# Altium project Audio_DevBoard_V1.PrjPcb
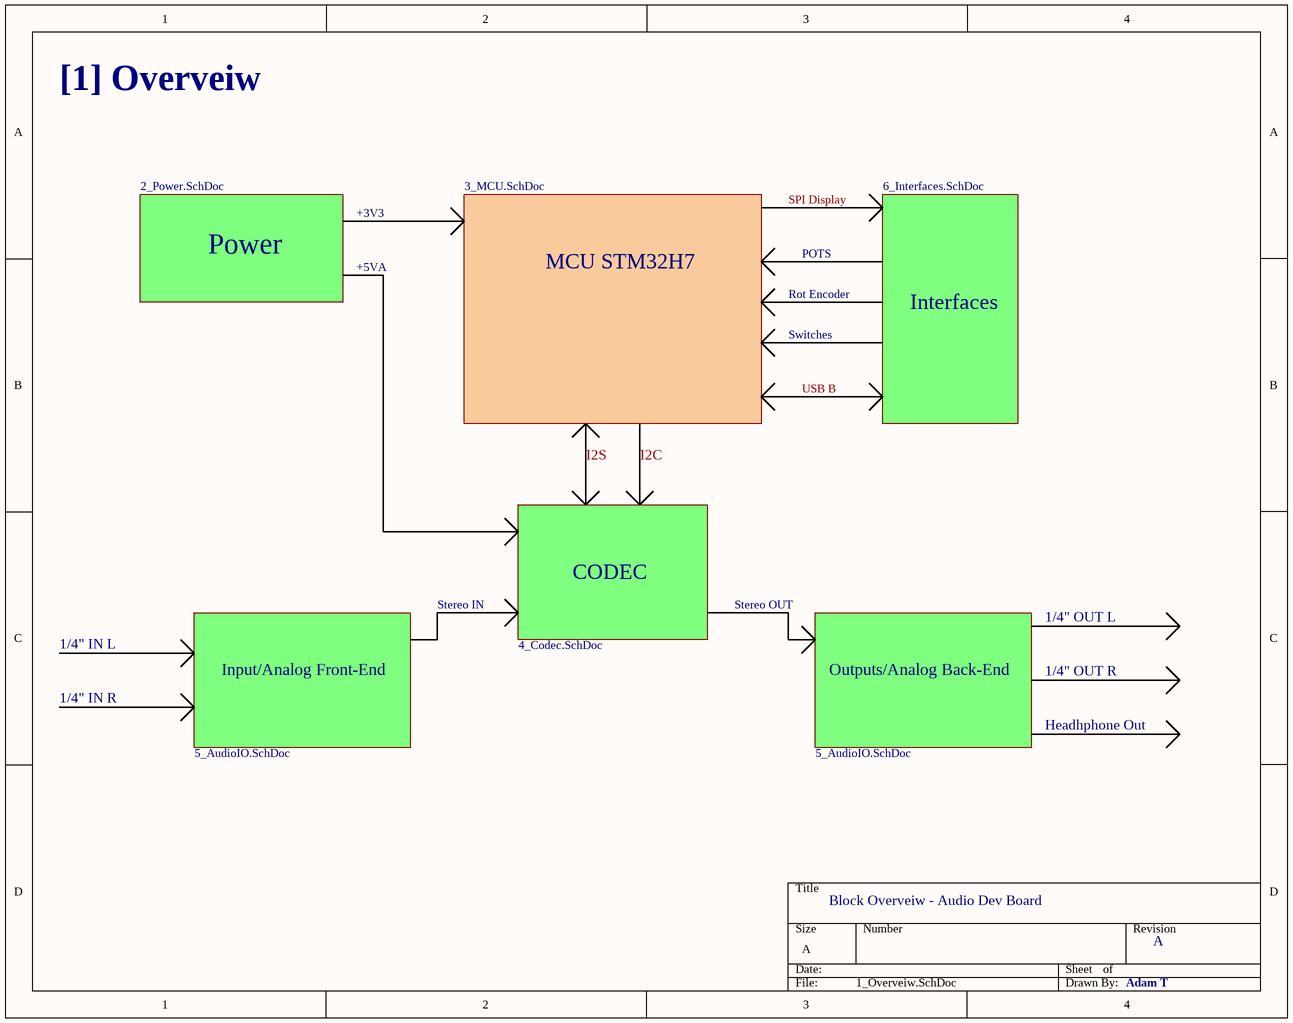
[diagram p0: 1_Overveiw.SchDoc]
6 sheets, 326 parts. Net scope: global (net labels, ports and power ports of the same name join across sheets).
Board file: Audio_DevBoard_V1_PCB.PcbDoc
Sheets:
  1_Overveiw.SchDoc
    Power = 2_Power.SchDoc
    MCU STM32H7 = 3_MCU.SchDoc
    CODEC = 4_Codec.SchDoc
    Input/Analog Front-End = 5_AudioIO.SchDoc
    Interfaces = 6_Interfaces.SchDoc
    Outputs/Analog Back-End = 5_AudioIO.SchDoc

## Sheet 1_Overveiw.SchDoc
size A; SheetNumber: 1; SheetTotal: 6

### Sub-sheets
CODEC = 4_Codec.SchDoc: no entries
Input/Analog Front-End = 5_AudioIO.SchDoc: no entries
Interfaces = 6_Interfaces.SchDoc: no entries
MCU STM32H7 = 3_MCU.SchDoc: no entries
Outputs/Analog Back-End = 5_AudioIO.SchDoc: no entries
Power = 2_Power.SchDoc: no entries

### Notes on the sheet
- [1] Overveiw
- +3V3
- SPI Display
- +5VA
- Rot Encoder
- POTS
- Switches
- USB B
- I2S
- I2C
- Stereo IN
- Stereo OUT
- 1/4" OUT L
- 1/4" IN L
- 1/4" IN R
- 1/4" OUT R
- Headhphone Out
- Block Overveiw - Audio Dev Board
- A
- Adam T

## Sheet 2_Power.SchDoc
size A; SheetNumber: 2; SheetTotal: 6
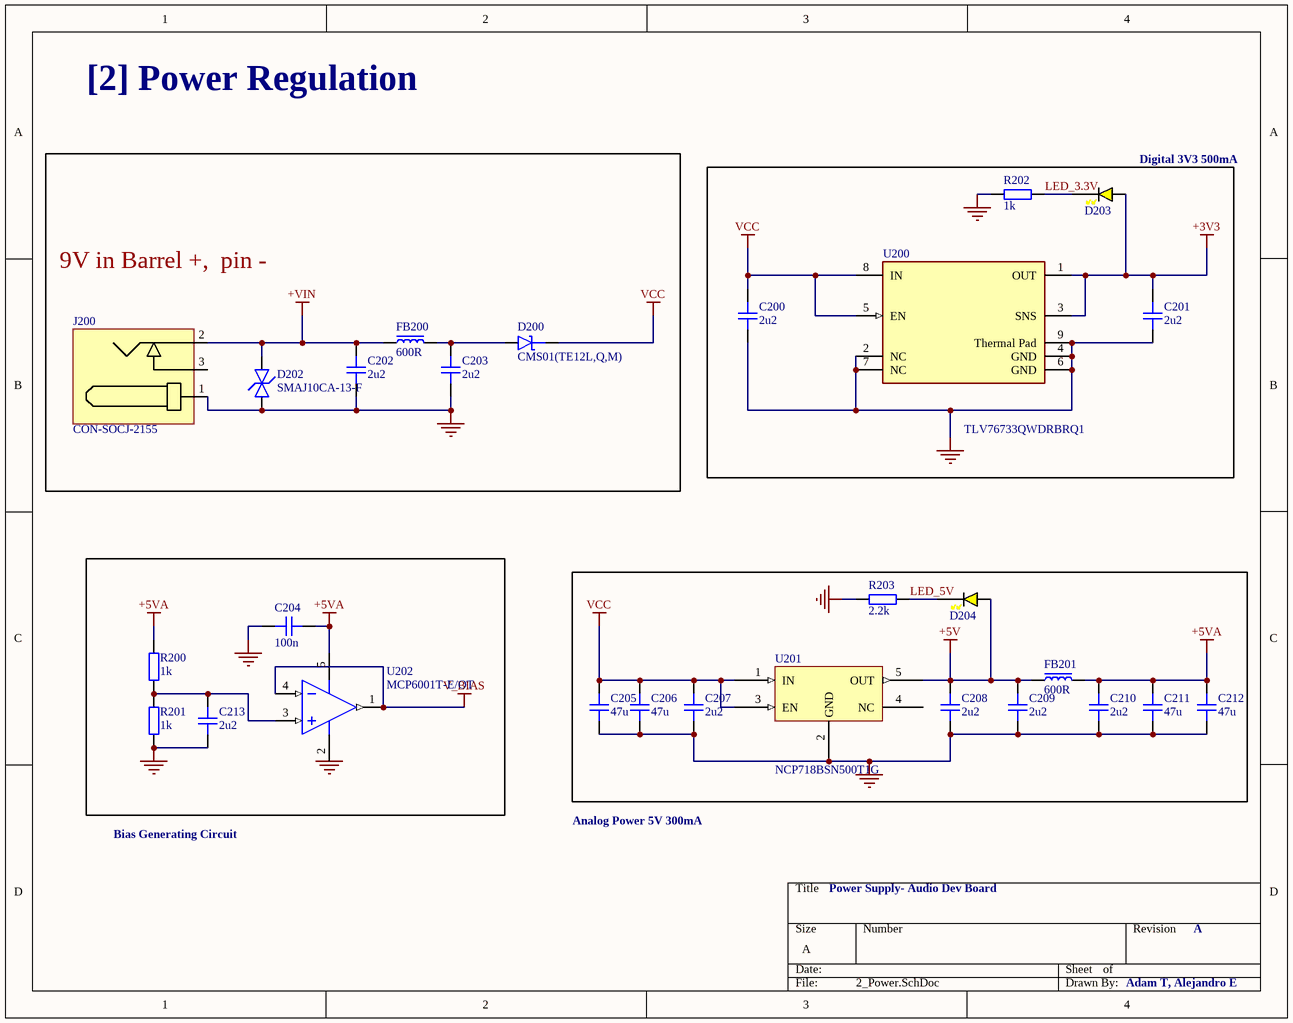
[diagram p1: 2_Power.SchDoc]

### Parts
C200  2u2  [CAP_0402]
C201  2u2  [CAP_0402]
C202  2u2  [CAP_0402]
C203  2u2  [CAP_0402]
C204  100n  [CAP_0402]
C205  47u  [CAP_1210]
C206  47u  [CAP_1210]
C207  2u2  [CAP_0402]
C208  2u2  [CAP_0402]
C209  2u2  [CAP_0402]
C210  2u2  [CAP_0402]
C211  47u  [CAP_1210]
C212  47u  [CAP_1210]
C213  2u2  [CAP_0402]
D200  CMS01(TE12L,Q,M)  [SOD_128]
D202  SMAJ10CA-13-F  [SMAJ10CA-13-F]
D203  YELLOW  [LED_0402_YELLOW]  (value not drawn)
D204  YELLOW  [LED_0402_YELLOW]  (value not drawn)
FB200  600R  [FB_0805]
FB201  600R  [FB_0805]
J200  CON-SOCJ-2155  [CON-SOCJ-2155]
R200  1k  [RES_0402]
R201  1k  [RES_0402]
R202  1k  [RES_0402]
R203  2.2k  [RES_0402]
U200  TLV76733QWDRBRQ1  [FP-DRB0008J-IPC_C]
U201  NCP718BSN500T1G  [TSOT25]
U202  MCP6001T-E/OT  [SOT-23-OT5_L]

### Blocks framed on the sheet
9V in Barrel +,  pin -: C202 C203 D200 D202 FB200 J200
Digital 3V3 500mA: C200 C201 D203 R202 U200

### Nets
+3V3: C201.2 D203.A U200.1(OUT) U200.3(SNS)
+5V: C208.2 C209.2 D204.A FB201.1 U201.5(OUT)
+5VA: C204.1 C210.2 C211.2 C212.2 FB201.2 R200.2 U202.5(VDD)
+VIN: C202.2 D202.K FB200.1 J200.2
GND: C200.1 C201.1 C202.1 C203.1 C204.2 C205.1 C206.1 C207.1 C208.1 C209.1 C210.1 C211.1 C212.1 C213.1 D202.A J200.1 R201.1 R202.1 R203.1 U200.2(NC) U200.4(GND) U200.6(GND) U200.7(NC) U200.9(Thermal_Pad) U201.2(GND) U202.2(VSS)
V_BIAS: U202.1(VOUT) U202.4(VIN-)
VCC: C200.2 C205.2 C206.2 C207.2 D200.K U200.5(EN) U200.8(IN) U201.1(IN) U201.3(EN)
LED_3.3V: D203.K R202.2
LED_5V: D204.K R203.2
NetC203_2: C203.2 D200.A FB200.2
NetC213_2: C213.2 R200.1 R201.2 U202.3(VIN+)

Not connected (* = marked no-connect by the designer): J200 3; U201 4(NC)

### Notes on the sheet
- [2] Power Regulation
- Bias Generating Circuit
- Analog Power 5V 300mA
- Power Supply- Audio Dev Board
- A
- Adam T, Alejandro E

### Library data of the parts
C200-C204 C207-C210 C213 = CAP_0402: Capacitor SMD 0402; Manufacturer: *; Manufacturer Part Number: *; Distributor Link: *; LCSC: *; Rating: *; Dielectric: *
C205 C206 C211 C212 = CAP_1210: Capacitor SMD 1210; Manufacturer: *; Manufacturer Part Number: *; Distributor Link: *; LCSC: *; Rating: *; Dielectric: *
D200 = D_SCHOTTKY_SOD_128: Diode 30 V 3A Surface Mount M-FLAT (2.4x3.8) / SOD-128
D202 = SMAJ10CA-13-F: TVS DIODE 10VWM 17VC SMA (DO-214AC)
D203 D204 = LED_0402_YELLOW: LED 0402 YELLOW SMD
FB200 FB201 = FB_0805: Ferrite Bead SMD 0805 C2982098; Manufacturer: *; Manufacturer Part Number: *; Distributor Link: *; LCSC: *
J200 = CON-SOCJ-2155: DC Barrell Jack 2.1mm 30V 2.5A THT; Manufacturer: Gravitech; Manufacturer Part Number: CON-SOCJ-2155
R200-R203 = RES_0402: Resistor SMD 0402
  R200 R201: Manufacturer: *; Manufacturer Part Number: *; Distributor Link: *; LCSC: *
U200 = CMP-04917-000370-1: IC OPAMP; RoHS Compliant: Yes
U201 = NCP718BSN500T1G: Linear Voltage Regulator IC Positive Fixed 1 Output 300mA TSOT-23-5
U202 = CMP-0187-00458-3: None; Output Current: 23mA; Number of Circuits: 1; Input Offset Voltage-Max: 4.5mV; Nominal Supply Current: 100uA; Min Supply Voltage: 1.8V; Voltage: 6V; Operating Supply Voltage: 5.5V; Gain Bandwidth Product: 1MHz; Amplifier Type: GENERAL PURPOSE; Voltage Gain: 112dB; Slew Rate: 0.6V/µs; Power Supply Rejection Ratio (PSRR): 86dB; Input Bias Current: 1pA; Common Mode Rejection Ratio: 60dB; Package Quantity: 3000; Lead Free: Lead Free; Case/Package: SOT-23; Max Operating Temperature: 125°C; RoHS Compliant: Yes; Radiation Hardening: No; Number of Channels: 1; Length: 3.1mm; Height: 1.3mm; Output Current per Channel: 23mA; Supply Current: 100uA; Packaging: Tape and Reel; Technology: CMOS; Number of Elements: 1; Number of Pins: 5; Input Offset Voltage (Vos): 4.5mV; Width: 1.8mm; Contact Plating: Tin; Mount: Surface Mount; Slew Rate-Nom: 0.6V/µs; Unity Gain Bandwidth Product: 1MHz; REACH SVHC: No SVHC; Number of Amplifiers: 1; Max Supply Voltage: 6V; Operating Supply Current: 100uA; Min Operating Temperature: -40°C; Bandwidth: 1MHz

## Sheet 3_MCU.SchDoc
size B; SheetNumber: 3; SheetTotal: 6
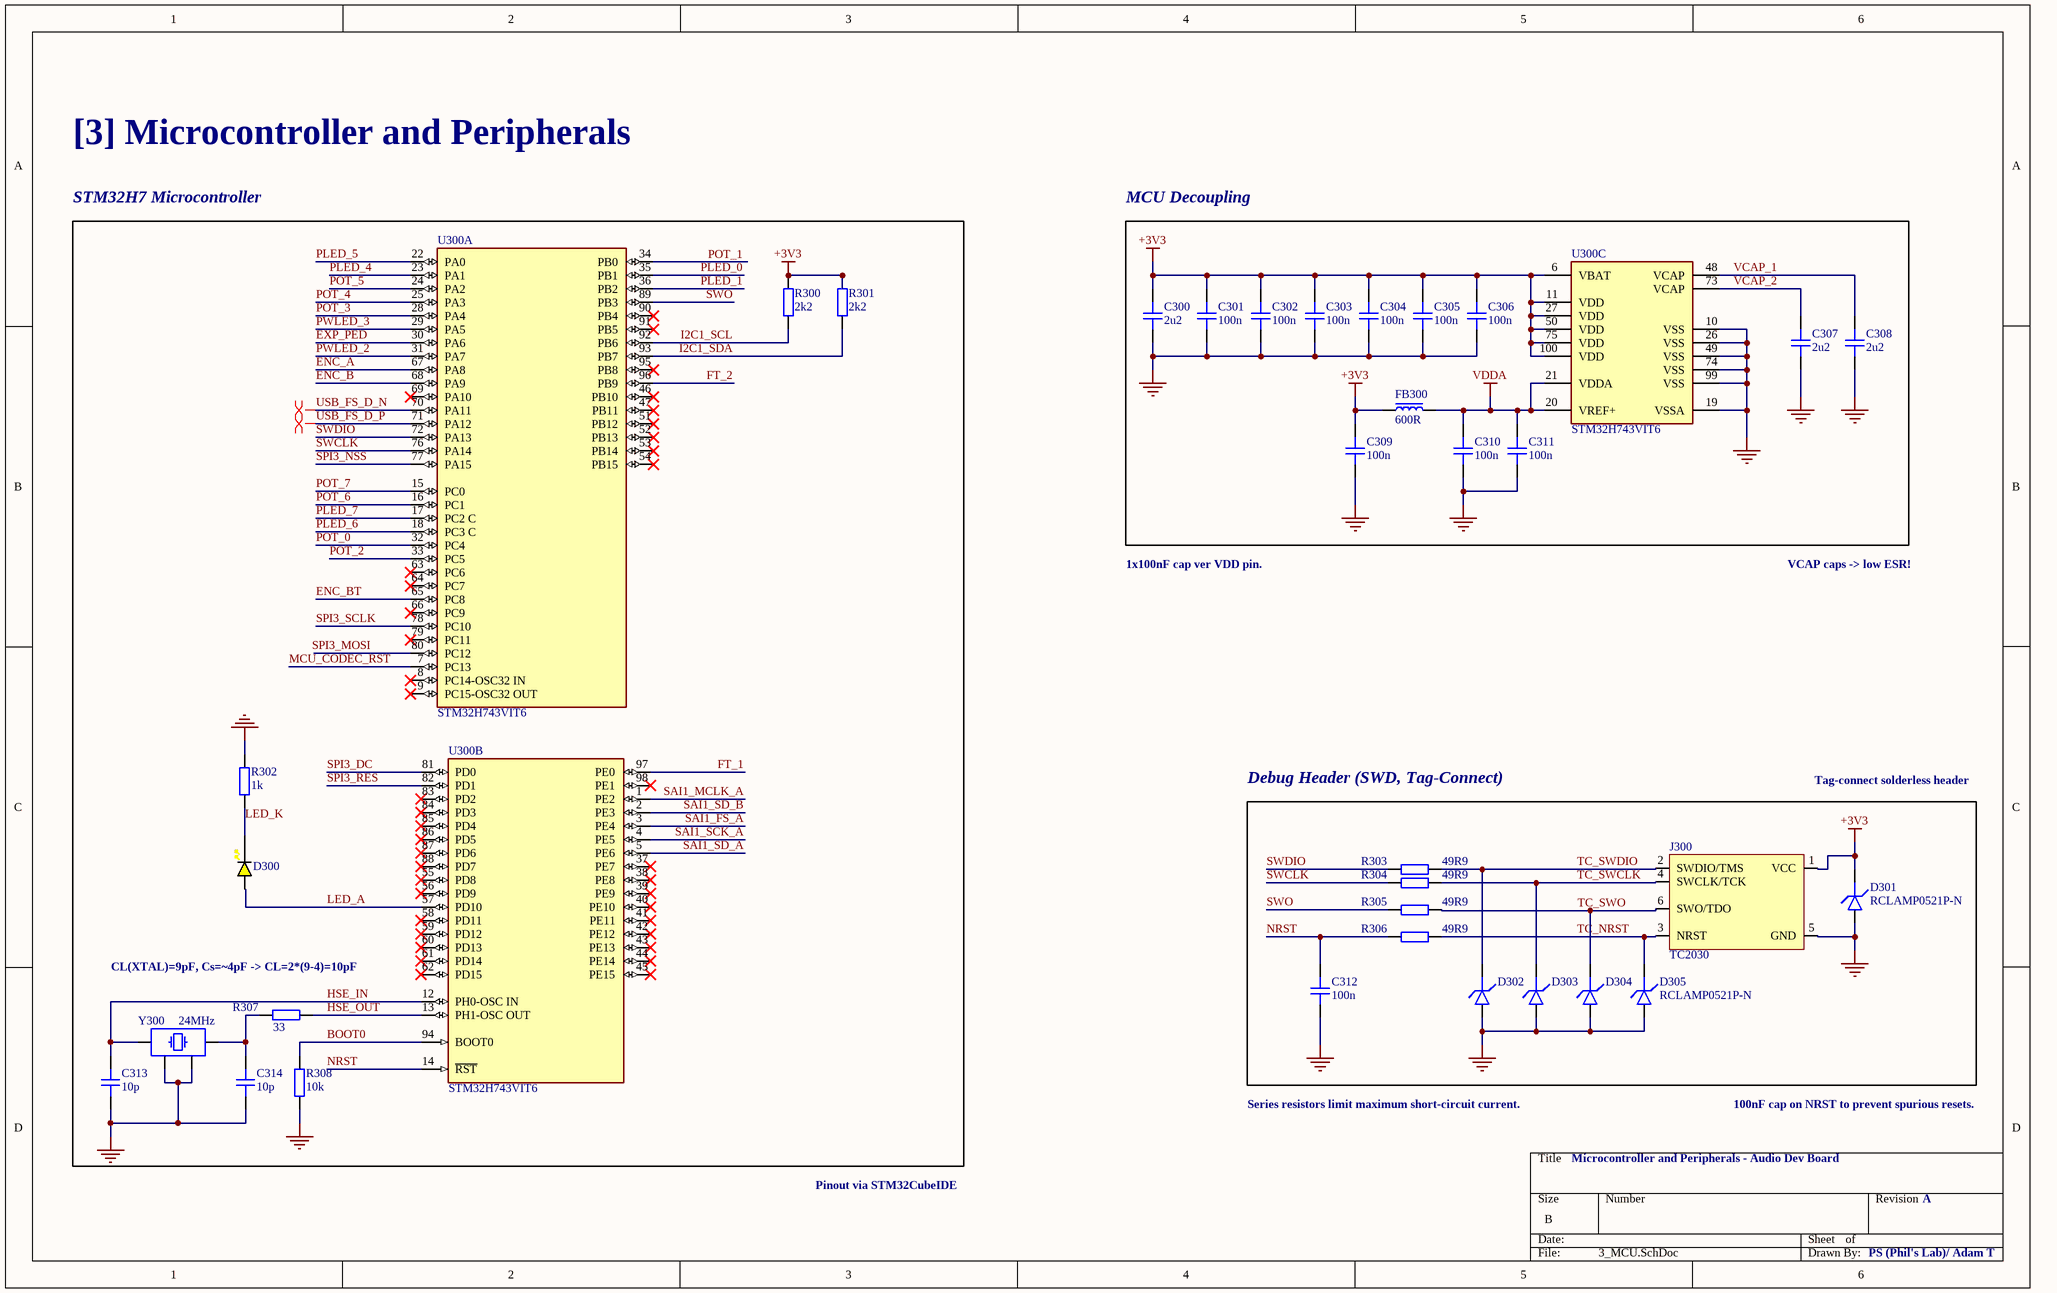
[diagram p2: 3_MCU.SchDoc]

### Parts
C300  2u2  [CAP_0603]
C301  100n  [CAP_0402]
C302  100n  [CAP_0402]
C303  100n  [CAP_0402]
C304  100n  [CAP_0402]
C305  100n  [CAP_0402]
C306  100n  [CAP_0402]
C307  2u2  [CAP_0402]
C308  2u2  [CAP_0402]
C309  100n  [CAP_0402]
C310  100n  [CAP_0402]
C311  100n  [CAP_0402]
C312  100n  [CAP_0402]
C313  10p  [CAP_0402]
C314  10p  [CAP_0402]
D300  YELLOW  [LED_0402_YELLOW]  (value not drawn)
D301  RCLAMP0521P-N  [D_0402]
D302  RCLAMP0521P-N  [D_0402]  (value not drawn)
D303  RCLAMP0521P-N  [D_0402]  (value not drawn)
D304  RCLAMP0521P-N  [D_0402]  (value not drawn)
D305  RCLAMP0521P-N  [D_0402]
FB300  600R  [FB_0805]
J300  TC2030  [TC2030-FP]  (no BOM)
R300  2k2  [RES_0402]
R301  2k2  [RES_0402]
R302  1k  [RES_0402]
R303  49R9  [RES_0402]
R304  49R9  [RES_0402]
R305  49R9  [RES_0402]
R306  49R9  [RES_0402]
R307  33  [RES_0402]
R308  10k  [RES_0402]
U300  STM32H743VIT6  [FP-LQFP100-1L-MFG]  (parts A,B,C of 3)
Y300  24MHz  [XTAL_3225]

### Blocks framed on the sheet
STM32H7 Microcontroller: C313 C314 D300 R300-R302 R307 R308 U300 Y300
MCU Decoupling: C300-C311 FB300 U300
Debug Header (SWD, Tag-Connect): C312 D301-D305 J300 R303-R306

### Nets
+3V3: C300.2 C301.2 C302.2 C303.2 C304.2 C305.2 C306.2 C309.2 D301.K FB300.1 J300.1(VCC) R300.2 R301.2 U300.6(VBAT) U300.11(VDD) U300.27(VDD) U300.50(VDD) U300.75(VDD) U300.100(VDD)
GND: C300.1 C301.1 C302.1 C303.1 C304.1 C305.1 C306.1 C307.1 C308.1 C309.1 C310.1 C311.1 C312.1 C313.1 C314.1 D301.A D302.A D303.A D304.A D305.A J300.5(GND) R302.1 R308.1 U300.10(VSS) U300.19(VSSA) U300.26(VSS) U300.49(VSS) U300.74(VSS) U300.99(VSS) Y300.2 Y300.4
VDDA: C310.2 C311.2 FB300.2 U300.20(VREF+) U300.21(VDDA)
BOOT0: R308.2 U300.94(BOOT0)
ENC_A: U300.67(PA8)
ENC_B: U300.68(PA9)
ENC_BT: U300.65(PC8)
EXP_PED: U300.30(PA6)
FT_1: U300.97(PE0)
FT_2: U300.96(PB9)
HSE_IN: C313.2 U300.12(PH0-OSC_IN) Y300.1
HSE_OUT: R307.2 U300.13(PH1-OSC_OUT)
I2C1_SCL: R300.1 U300.92(PB6)
I2C1_SDA: R301.1 U300.93(PB7)
LED_A: D300.A U300.57(PD10)
LED_K: D300.K R302.2
MCU_CODEC_RST: U300.7(PC13)
NRST: C312.2 R306.1 U300.14(~{RST})
PLED_0: U300.35(PB1)
PLED_1: U300.36(PB2)
PLED_4: U300.23(PA1)
PLED_5: U300.22(PA0)
PLED_6: U300.18(PC3_C)
PLED_7: U300.17(PC2_C)
POT_0: U300.32(PC4)
POT_1: U300.34(PB0)
POT_2: U300.33(PC5)
POT_3: U300.28(PA4)
POT_4: U300.25(PA3)
POT_5: U300.24(PA2)
POT_6: U300.16(PC1)
POT_7: U300.15(PC0)
PWLED_2: U300.31(PA7)
PWLED_3: U300.29(PA5)
SAI1_FS_A: U300.3(PE4)
SAI1_MCLK_A: U300.1(PE2)
SAI1_SCK_A: U300.4(PE5)
SAI1_SD_A: U300.5(PE6)
SAI1_SD_B: U300.2(PE3)
SPI3_DC: U300.81(PD0)
SPI3_MOSI: U300.80(PC12)
SPI3_NSS: U300.77(PA15)
SPI3_RES: U300.82(PD1)
SPI3_SCLK: U300.78(PC10)
SWCLK: R304.1 U300.76(PA14)
SWDIO: R303.1 U300.72(PA13)
SWO: R305.1 U300.89(PB3)
TC_NRST: D305.K J300.3(NRST) R306.2
TC_SWCLK: D303.K J300.4(SWCLK/TCK) R304.2
TC_SWDIO: D302.K J300.2(SWDIO/TMS) R303.2
TC_SWO: D304.K J300.6(SWO/TDO) R305.2
USB_FS_D_N: U300.70(PA11)
USB_FS_D_P: U300.71(PA12)
VCAP_1: C308.2 U300.48(VCAP)
VCAP_2: C307.2 U300.73(VCAP)
NetC314_2: C314.2 R307.1 Y300.3

Not connected (* = marked no-connect by the designer): U300 8(PC14-OSC32_IN)* 9(PC15-OSC32_OUT)* 37(PE7)* 38(PE8)* 39(PE9)* 40(PE10)* 41(PE11)* 42(PE12)* 43(PE13)* 44(PE14)* 45(PE15)* 46(PB10)* 47(PB11)* 51(PB12)* 52(PB13)* 53(PB14)* 54(PB15)* 55(PD8)* 56(PD9)* 58(PD11)* 59(PD12)* 60(PD13)* 61(PD14)* 62(PD15)* 63(PC6)* 64(PC7)* 66(PC9)* 69(PA10)* 79(PC11)* 83(PD2)* 84(PD3)* 85(PD4)* 86(PD5)* 87(PD6)* 88(PD7)* 90(PB4)* 91(PB5)* 95(PB8)* 98(PE1)*

### Layout directives
differential pair; differential pair class DIFF_USB: USB_FS_D_N, USB_FS_D_P

### Notes on the sheet
- [3] Microcontroller and Peripherals
- 1x100nF cap ver VDD pin.
- VCAP caps -> low ESR!
- Tag-connect solderless header
- (near R307) CL(XTAL)=9pF, Cs=~4pF -> CL=2*(9-4)=10pF
- Series resistors limit maximum short-circuit current.
- 100nF cap on NRST to prevent spurious resets.
- Microcontroller and Peripherals - Audio Dev Board
- Pinout via STM32CubeIDE
- A
- PS (Phil's Lab)/ Adam T

### Library data of the parts
C300 = CAP_0603_16V: Capacitor SMD 0603 16V
C301-C312 = CAP_0402: Capacitor SMD 0402; Manufacturer: *; Manufacturer Part Number: *; Distributor Link: *; LCSC: *; Rating: *; Dielectric: *
C313 C314 = CAP_0402_16V: Capacitor SMD 0402 16V
D300 = LED_0402_YELLOW: LED 0402 YELLOW SMD
D301-D305 = D_TVS_0402: Diode TVS / ESD 0402
FB300 = FB_0805: Ferrite Bead SMD 0805 C2982098; Manufacturer: *; Manufacturer Part Number: *; Distributor Link: *; LCSC: *
J300 = TC2030: Tag-Connect No-Solder SWD Debug Connector DO NOT PLACE; Manufacturer: Tag-Connect; Manufacturer Part Number: TC2030
R300-R308 = RES_0402: Resistor SMD 0402
U300 = CMP-12105-000050-1: IC MCU 32BIT 2MB FLASH 100LQFP; Manufacturer: STMicroelectronics; Number Of Ethernet Channels: 1; Number Of Usb Channels: 2; Number Of A/D Converters: 3; Min Supply Voltage: 1.71V; Ram Size: 1060KBytes; Number Of I2C Channels: 4; Frequency: 480MHz; Number Of Adc Channels: 36; Number Of I/Os: 82; Max Supply Voltage: 3.6V; Number Of Spi Channels: 6; Memory Size: 2MBytes; Max Junction Temp: +125°C; Core Architecture: Arm Cortex-M7; Interface: I2C,SPI,UART,USART,USB,LIN,IrDA,Ethernet,I2S,Other; Number Of Timers/Counters: 20; Data Bus Width: 32bits; Number Of Pwm Channels: 42; Number Of Uart Channels: 9; Standoff Height: 0.05mm; Device Class L1: Integrated Circuits (ICs); ComponentLink2URL: https://www.st.com/resource/en/datasheet/stm32h743vi.pdf; Automotive: No; Memory Type: FLASH; Number Of Cores: 1; Temperature Range Low: -40°C; RoHS: TRUE; Ambient Temperature Range Low: -40°C; ComponentLink2Description: Datasheet; Device Class L2: Embedded Processors and Controllers; Device Class L3: Microcontrollers; Digikey Description: IC MCU 32BIT 2MB FLASH 100LQFP; Temperature Range High: +125°C; Ambient Temperature Range High: +85°C; Package: LQFP100-1L; Temperature: -40°C to +125°C; Category: IC; Ipc Land Pattern Name: QFP50P1600X1600X160-100; Height: 1.6mm; Manufacturer Part Number: STM32H743VIT6; Octopart: https://octopart.com/stm32h743vit6-stmicroelectronics-76372527; Lead Free: Yes
Y300 = TSX-3225_24.0000MF15X-AC: Crystal SMD 24MHz 10PPM 7pF 3225; Manufacturer: Epson; Manufacturer Number: TSX-3225 24.0000MF15X-AC; ESR: 40R; Value: 24MHz; Type: XTAL; Load Capacitance: 7pF

## Sheet 4_Codec.SchDoc
size A; SheetNumber: 4; SheetTotal: 6
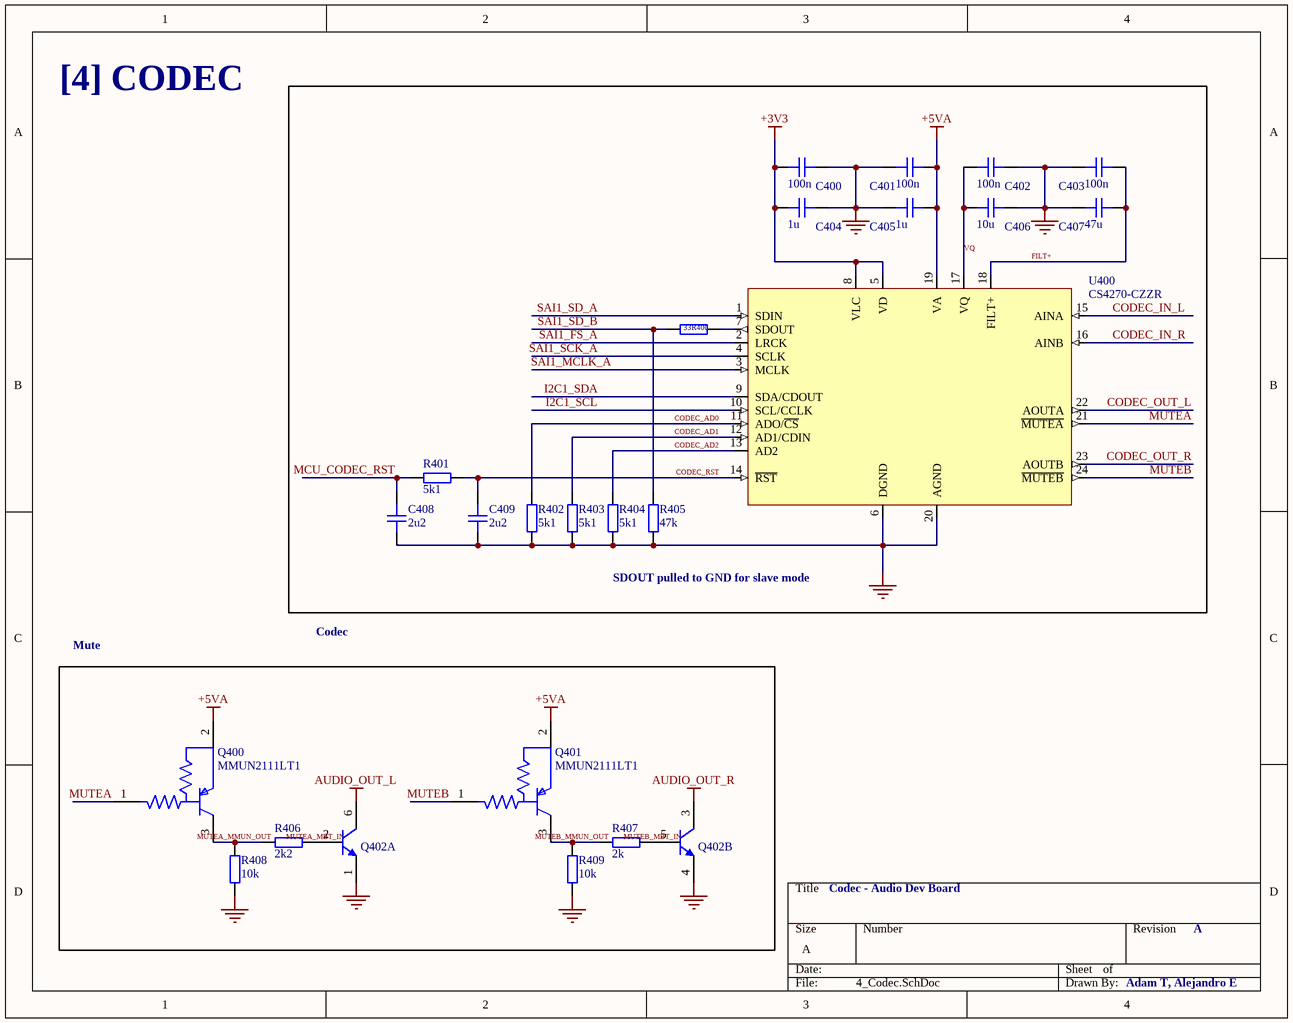
[diagram p3: 4_Codec.SchDoc]

### Parts
C400  100n  [CAP_0402]
C401  100n  [CAP_0402]
C402  100n  [CAP_0402]
C403  100n  [CAP_0402]
C404  1u  [CAP_0603]
C405  1u  [CAP_0603]
C406  10u  [CAP_0603]
C407  47u  [CAP_1210]
C408  2u2  [CAP_0402]
C409  2u2  [CAP_0402]
Q400  MMUN2111LT1  [FP-318-08-MFG]
Q401  MMUN2111LT1  [FP-318-08-MFG]
Q402  MBT3904DW1T1G  [ONSC-SOT-363-6-419B-02_W_V]  (value not drawn)  (parts A,B of 2)
R400  33  [RES_0402]
R401  5k1  [RES_0402]
R402  5k1  [RES_0402]
R403  5k1  [RES_0402]
R404  5k1  [RES_0402]
R405  47k  [RES_0402]
R406  2k2  [RES_0402]
R407  2k  [RES_0402]
R408  10k  [RES_0402]
R409  10k  [RES_0402]
U400  CS4270-CZZR  [TSSOP-24]

### Blocks framed on the sheet
SDOUT pulled to GND for slave mode: C400-C409 R400-R405 U400
Mute: Q400-Q402 R406-R409

### Nets
+3V3: C400.1 C404.2 U400.5(VD) U400.8(VLC)
+5VA: C401.1 C405.2 Q400.2(E) Q401.2(E) U400.19(VA)
AUDIO_OUT_L: Q402.6(C)
AUDIO_OUT_R: Q402.3(C)
GND: C400.2 C401.2 C402.2 C403.2 C404.1 C405.1 C406.1 C407.1 C408.1 C409.1 Q402.1(E) Q402.4(E) R402.1 R403.1 R404.1 R405.1 R408.1 R409.1 U400.6(DGND) U400.20(AGND)
CODEC_AD0: R402.2 U400.11(ADO/~{CS})
CODEC_AD1: R403.2 U400.12(AD1/CDIN)
CODEC_AD2: R404.2 U400.13(AD2)
CODEC_IN_L: U400.15(AINA)
CODEC_IN_R: U400.16(AINB)
CODEC_OUT_L: U400.22(AOUTA)
CODEC_OUT_R: U400.23(AOUTB)
CODEC_RST: C409.2 R401.1 U400.14(~{RST})
FILT+: C403.1 C407.2 U400.18(FILT+)
I2C1_SCL: U400.10(SCL/CCLK)
I2C1_SDA: U400.9(SDA/CDOUT)
MCU_CODEC_RST: C408.2 R401.2
MUTEA: Q400.1(B) U400.21(~{MUTEA})
MUTEA_MBT_IN: Q402.2(B) R406.2
MUTEA_MMUN_OUT: Q400.3(C) R406.1 R408.2
MUTEB: Q401.1(B) U400.24(~{MUTEB})
MUTEB_MBT_IN: Q402.5(B) R407.2
MUTEB_MMUN_OUT: Q401.3(C) R407.1 R409.2
SAI1_FS_A: U400.2(LRCK)
SAI1_MCLK_A: U400.3(MCLK)
SAI1_SCK_A: U400.4(SCLK)
SAI1_SD_A: U400.1(SDIN)
SAI1_SD_B: R400.1 R405.2
VQ: C402.1 C406.2 U400.17(VQ)
NetR400_2: R400.2 U400.7(SDOUT)

### Notes on the sheet
- [4] CODEC
- Codec
- Codec - Audio Dev Board
- A
- Adam T, Alejandro E

### Library data of the parts
C400-C403 C408 C409 = CAP_0402: Capacitor SMD 0402; Manufacturer: *; Manufacturer Part Number: *; Distributor Link: *; LCSC: *; Rating: *; Dielectric: *
C404-C406 = CAP_0603: Capacitor SMD 0603; Manufacturer: *; Manufacturer Part Number: *; Distributor Link: *; LCSC: *; Rating: *; Dielectric: *
C407 = CAP_1210: Capacitor SMD 1210; Manufacturer: *; Manufacturer Part Number: *; Distributor Link: *; LCSC: *; Rating: *; Dielectric: *
Q400 Q401 = CMP-00278-00358179-1: MMUN2111LT1 Small Signal Bipolar Transistor, 0.1A I(C), 50V V(BR)CEO, 1-Element, PNP, Silicon, TO-236AB; NexarPartId: 358179; Power Dissipation: 246mW; Current Rating: -100mA; Current: 1A; Max Junction Temperature (Tj): 150°C; Number of Elements: 1; Max Collector Current: 100mA; Element Configuration: Single; Voltage Rating (DC): -50V; hFE Min: 35; Collector Emitter Saturation Voltage: 250mV; Collector Base Voltage (VCBO): 50V; Min Operating Temperature: -55°C; Max Operating Temperature: 150°C; Packaging: Cut Tape (CT); Collector Emitter Voltage (VCEO): 50V; Max Power Dissipation: 246mW; Height: 1.11mm; Case/Package: SOT-23-3; Continuous Collector Current: 100mA; Number of Pins: 3; Voltage: 50V; RoHS: Compliant; Collector Emitter Breakdown Voltage: 50V; Mount: Surface Mount; Lead Free: Contains Lead; Polarity: PNP
Q402 = CMP-1048-00877-1: Dual General Purpose Transistors, 6-Pin SOT-363, Pb-Free, Tape and Reel; Manufacturer: On Semiconductor; Polarity: Dual NPN; fT Min (MHz): 300; IC Continuous (A): 0.2; DatasheetVersion: Rev. 9; ComponentLink2Description: Datasheet; Mounting Technology: Surface Mount; PackageReference: SOT-363-6-419B-02_W; RoHS: TRUE; ComponentLink1Description: Manufacturer URL; ComponentLink2URL: http://www.onsemi.com/pub_link/Collateral/MBT3904DW1T1-D.PDF; PackageVersion: Rev. W, 01/2006; Packing: Tape and Reel; PartNumber: MBT3904DW1T1G; ComponentLink1URL: http://www.onsemi.com/; ComponentLink3URL: http://www.onsemi.com/pub_link/Collateral/NTJD4001N-D.PDF; ComponentLink3Description: Package Specification; PackageDescription: 6-Pin Small Outline Transistor, Body 2 x 1.25 mm, Pitch 0.65 mm
R400-R409 = RES_0402: Resistor SMD 0402
  R401-R409: Manufacturer: *; Manufacturer Part Number: *; Distributor Link: *; LCSC: *
U400 = CS4270-CZZR: 24-Bit 192kHz Stereo Audio Codec TSSOP-24; Manufacturer: Cirrus Logic; Manufacturer Part Number: CS4270-CZZR

## Sheet 5_AudioIO.SchDoc
size B; SheetNumber: 5; SheetTotal: 6
Used 2 times, as channels Input/Analog Front-End, Outputs/Analog Back-End. Parts and nets are listed once, with the designators drawn on the sheet.
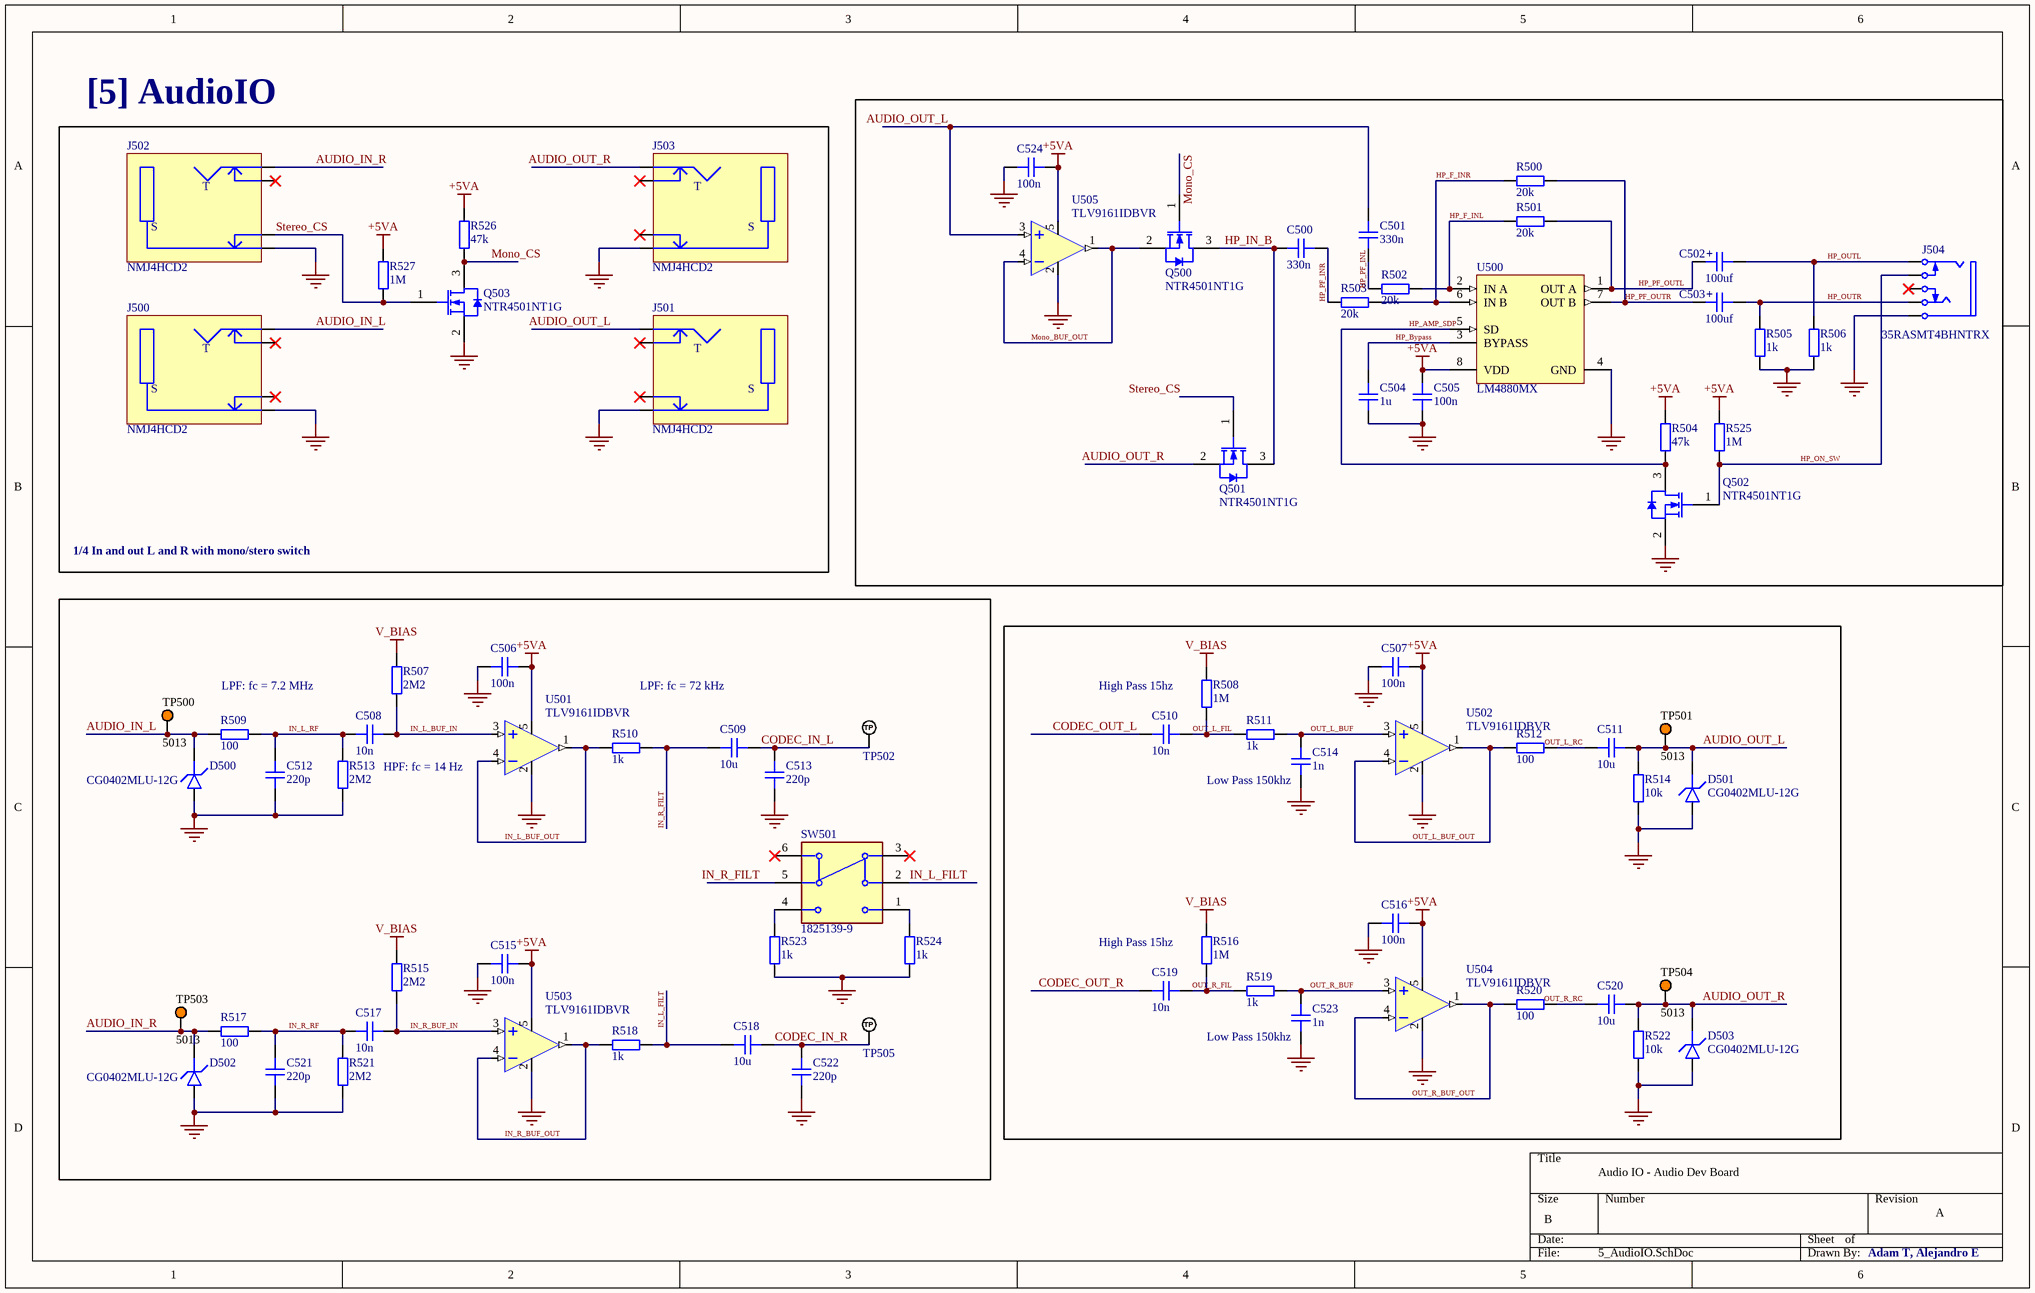
[diagram p4: 5_AudioIO.SchDoc]

### Parts
C500  330n  [CAP_0603]
C501  330n  [CAP_0603]
C502  100uf  [CAP_AE_SMD_D6MM3_H5M55]
C503  100uf  [CAP_AE_SMD_D6MM3_H5M55]
C504  1u  [CAP_0603]
C505  100n  [CAP_0402]
C506  100n  [CAP_0402]
C507  100n  [CAP_0402]
C508  10n  [CAP_0402]
C509  10u  [CAP_0603]
C510  10n  [CAP_0402]
C511  10u  [CAP_0603]
C512  220p  [CAP_0402]
C513  220p  [CAP_0402]
C514  1n  [CAP_0402]
C515  100n  [CAP_0402]
C516  100n  [CAP_0402]
C517  10n  [CAP_0402]
C518  10u  [CAP_0603]
C519  10n  [CAP_0402]
C520  10u  [CAP_0603]
C521  220p  [CAP_0402]
C522  220p  [CAP_0402]
C523  1n  [CAP_0402]
C524  100n  [CAP_0402]
D500  CG0402MLU-12G  [D_0402]
D501  CG0402MLU-12G  [D_0402]
D502  CG0402MLU-12G  [D_0402]
D503  CG0402MLU-12G  [D_0402]
J500  NMJ4HCD2  [NMJ4HCD2]
J501  NMJ4HCD2  [NMJ4HCD2]
J502  NMJ4HCD2  [NMJ4HCD2]
J503  NMJ4HCD2  [NMJ4HCD2]
J504  35RASMT4BHNTRX  [SWIT-35RASMT4BHNTRX_V]
Q500  NTR4501NT1G  [ONSC-SOT-23-3-318-08_V]
Q501  NTR4501NT1G  [ONSC-SOT-23-3-318-08_V]
Q502  NTR4501NT1G  [ONSC-SOT-23-3-318-08_V]
Q503  NTR4501NT1G  [ONSC-SOT-23-3-318-08_V]
R500  20k  [RES_0402]
R501  20k  [RES_0402]
R502  20k  [RES_0402]
R503  20k  [RES_0402]
R504  47k  [RES_0402]
R505  1k  [RES_0402]
R506  1k  [RES_0402]
R507  2M2  [RES_0402]
R508  1M  [RES_0402]
R509  100  [RES_0402]
R510  1k  [RES_0402]
R511  1k  [RES_0402]
R512  100  [RES_0402]
R513  2M2  [RES_0402]
R514  10k  [RES_0402]
R515  2M2  [RES_0402]
R516  1M  [RES_0402]
R517  100  [RES_0402]
R518  1k  [RES_0402]
R519  1k  [RES_0402]
R520  100  [RES_0402]
R521  2M2  [RES_0402]
R522  10k  [RES_0402]
R523  1k  [RES_0402]
R524  1k  [RES_0402]
R525  1M  [RES_0402]
R526  47k  [RES_0402]
R527  1M  [RES_0402]
SW501  1825139-9  [FP-1825139-9-MFG]
TP500  5013  [KSTN-5013_V]
TP501  5013  [KSTN-5013_V]
TP502  TP_NOBOM  [PAD_RND_1MM]  (value not drawn)  (no BOM)
TP503  5013  [KSTN-5013_V]
TP504  5013  [KSTN-5013_V]
TP505  TP_NOBOM  [PAD_RND_1MM]  (value not drawn)  (no BOM)
U500  LM4880MX  [M08A_L]
U501  TLV9161IDBVR  [SOT-23-5]
U502  TLV9161IDBVR  [SOT-23-5]
U503  TLV9161IDBVR  [SOT-23-5]
U504  TLV9161IDBVR  [SOT-23-5]
U505  TLV9161IDBVR  [SOT-23-5]

### Blocks framed on the sheet
[5] AudioIO: J500-J503 Q503 R526 R527

### Nets
+5VA: C505.2 C506.2 C507.2 C515.2 C516.2 C524.2 R504.2 R525.2 R526.1 R527.1 U500.8(VDD) U501.5(V+) U502.5(V+) U503.5(V+) U504.5(V+) U505.5(V+)
GND: C504.1 C505.1 C506.1 C507.1 C512.1 C513.1 C514.1 C515.1 C516.1 C521.1 C522.1 C523.1 C524.1 D500.A D501.A D502.A D503.A J500.S J501.S J502.S J503.S J504.1 Q502.2(S) Q503.2(S) R505.1 R506.1 R513.1 R514.2 R521.1 R522.2 R523.1 R524.1 U500.4(GND) U501.2(V-) U502.2(V-) U503.2(V-) U504.2(V-) U505.2(V-)
V_BIAS: R507.2 R508.2 R515.2 R516.2
AUDIO_IN_L: D500.K J500.T R509.1 TP500.1
AUDIO_IN_R: D502.K J502.T R517.1 TP503.1
AUDIO_OUT_L: C501.1 C511.2 D501.K J501.T R514.1 TP501.1 U505.3(IN+)
AUDIO_OUT_R: C520.2 D503.K J503.T Q501.2(S) R522.1 TP504.1
CODEC_IN_L: C509.1 C513.2 TP502.1(TP)
CODEC_IN_R: C518.1 C522.2 TP505.1(TP)
CODEC_OUT_L: C510.1
CODEC_OUT_R: C519.1
HP_AMP_SDP: Q502.3(D) R504.1 U500.5(SD)
HP_Bypass: C504.2 U500.3(BYPASS)
HP_F_INL: R501.1 R502.2 U500.2(IN_A)
HP_F_INR: R500.1 R503.2 U500.6(IN_B)
HP_IN_B: C500.2 Q500.3(D) Q501.3(D)
HP_ON_SW: J504.4 Q502.1(G) R525.1
HP_OUTL: C502.2 J504.2 R506.2
HP_OUTR: C503.2 J504.3 R505.2
HP_PF_INL: C501.2 R502.1
HP_PF_INR: C500.1 R503.1
HP_PF_OUTL: C502.1 R501.2 U500.1(OUT_A)
HP_PF_OUTR: C503.1 R500.2 U500.7(OUT_B)
IN_L_BUF_IN: C508.2 R507.1 U501.3(IN+)
IN_L_BUF_OUT: R510.1 U501.1(OUT) U501.4(IN-)
IN_L_FILT: C518.2 R518.2 SW501.2
IN_L_RF: C508.1 C512.2 R509.2 R513.2
IN_R_BUF_IN: C517.2 R515.1 U503.3(IN+)
IN_R_BUF_OUT: R518.1 U503.1(OUT) U503.4(IN-)
IN_R_FILT: C509.2 R510.2 SW501.5
IN_R_RF: C517.1 C521.2 R517.2 R521.2
Mono_BUF_OUT: Q500.2(S) U505.1(OUT) U505.4(IN-)
Mono_CS: Q500.1(G) Q503.3(D) R526.2
OUT_L_BUF: C514.2 R511.1 U502.3(IN+)
OUT_L_BUF_OUT: R512.2 U502.1(OUT) U502.4(IN-)
OUT_L_FIL: C510.2 R508.1 R511.2
OUT_L_RC: C511.1 R512.1
OUT_R_BUF: C523.2 R519.1 U504.3(IN+)
OUT_R_BUF_OUT: R520.2 U504.1(OUT) U504.4(IN-)
OUT_R_FIL: C519.2 R516.1 R519.2
OUT_R_RC: C520.1 R520.1
Stereo_CS: J502.SN Q501.1(G) Q503.1(G) R527.2
NetR523_2: R523.2 SW501.4
NetR524_2: R524.2 SW501.1

Not connected (* = marked no-connect by the designer): J500 SN* TN*; J501 SN* TN*; J502 TN*; J503 SN* TN*; J504 5*; SW501 3* 6*

### Channels
Input/Analog Front-End: designators end in _Input/Analog_Front-End
Outputs/Analog Back-End: designators end in _Outputs/Analog_Back-End

### Notes on the sheet
- 1/4 In and out L and R with mono/stero switch
- LPF: fc = 7.2 MHz
- LPF: fc = 72 kHz
- (near R508) High Pass 15hz
- HPF: fc = 14 Hz
- (near C514) Low Pass 150khz
- (near R516) High Pass 15hz
- (near C523) Low Pass 150khz
- Audio IO - Audio Dev Board
- A
- Adam T, Alejandro E
- (in symbol CAP_ALEL_6.3x5.5) +

### Library data of the parts
C500 C501 C504 C509 C511 C518 C520 = CAP_0603: Capacitor SMD 0603; Manufacturer: *; Manufacturer Part Number: *; Distributor Link: *; LCSC: *; Rating: *; Dielectric: *
C502 C503 = CAP_ALEL_6.3x5.5: Capacitor SMD Aluminium Electrolytic 6.3mm Diameter 5.5mm Height / RVT1C101M0605 / C37308; Manufacturer: *; Manufacturer Part Number: *; Distributor Link: *; LCSC: *
C505-C508 C510 C512-C517 C519 C521-C524 = CAP_0402: Capacitor SMD 0402; Manufacturer: *; Manufacturer Part Number: *; Distributor Link: *; LCSC: *; Rating: *; Dielectric: *
D500-D503 = D_TVS_0402: Diode TVS / ESD 0402
J500-J503 = NMJ4HCD2: 1/4" Mono Jack, TS Switched; Manufacturer: Neutrik; Manufacturer Part Number: NMJ4HCD2
J504 = CMP-1772-00001-1: Female 3.5 mm Phone Jack, 5 Position, Height 5 mm, RoHS, Tape and Reel; Current Rating: 50 mA; Voltage Rating (DC): 12 V; ComponentLink1URL: http://www.switchcraft.com/; ComponentLink2Description: Datasheet; ComponentLink2URL: http://www.switchcraft.com/Drawings/35rasmt4bhntrx_cd.pdf; PackageDescription: Female 3.5 mm Phone Jack, 5 Position, Height 5 mm; PackageReference: 35RASMT4BHNTRX; Mount: Through Hole; DatasheetVersion: Rev. C, 07/2014; Contact Material: Silver; ComponentLink1Description: Manufacturer URL; Packaging: Tape and Reel; RoHSCompliant: true; Contact Plating: Silver; Package Quantity: 3000
Q500-Q503 = CMP-1058-00732-1: Power MOSFET, 20 V, 3.2 A, Single N-Channel, 3-Pin SOT-23, Pb-Free, Tape and Reel; Manufacturer: On Semiconductor; VGS Max (V): 12; VGS(th) Max (V): 1.2; PD Max (W): 1.25; Coss Typ (pF): 80; Ciss Typ (pF): 200; V(BR)DSS Min (V): 20; Qrr Typ (nC): 3; Crss Typ (pF): 50; Channel Polarity: N Channel; RoHS: Pb-Free; ComponentLink3URL: http://www.onsemi.cn/pub_link/Collateral/318-08.PDF; ComponentLink2Description: Datasheet; PackageVersion: Rev. AP, 11/2009; Mounting Technology: Surface Mount; PackageDescription: 3-Pin Small Outline Transistor, Body 2.92 x 1.3 mm, Pitch 0.95 mm; PackageReference: SOT-23-3-318-08; ComponentLink1URL: http://www.onsemi.com/; Packing: Tape and Reel; Configuration: Single; ComponentLink2URL: http://www.onsemi.cn/pub_link/Collateral/NTR4501N-D.PDF; ComponentLink3Description: Package Specification; Package Type: SOT-23-3; ComponentLink1Description: Manufacturer URL; PartNumber: NTR4501NT1G; DatasheetVersion: Rev. 13
R500-R527 = RES_0402: Resistor SMD 0402; Manufacturer: *; Manufacturer Part Number: *; Distributor Link: *; LCSC: *
SW501 = CMP-03408-000019-1: SWITCH TOGGLE DPDT 5A 120V; Voltage Rating (AC): 125V; Illumination Type: Non-Illuminated; Sealable: Yes (With); Insulation Resistance: 1GR; Actuator Length: 10.41mm; Max Voltage Rating (AC): 250V; Actuator Material: Brass; Max Voltage Rating (DC): 28V; Switch Function: On-Off-On; Actuator Color: Chrome; Actuator Type: Standard Round; Electrical Life: 6000Cycles; Contact Resistance: 10MR; ELV: Compliant; Orientation: Straight; Series: Gemini A; RoHS Compliant: Yes; Termination: PC Pins; Max Operating Temperature: 85°C; Radiation Hardening: No; Contact Plating: Silver; Contact Material: Copper; Mount: Through Hole; Packaging: Bulk; Flammability Rating: UL94 V-1; Contact Current Rating: 5A; Throw Configuration: DPDT; Voltage Rating (DC): 28V; Type: Switch; Min Operating Temperature: -30°C
TP500 TP501 TP503 TP504 = CMP-1672-00005-4: Test Point, Orange, Through Hole, RoHS, Bulk; Manufacturer: Keystone; REACH SVHC: No SVHC; ComponentLink2Description: Datasheet; PackageDescription: 1-Pin Through Hole Device, Dia 3.17 mm; Package Quantity: 100; PackageReference: 5013; Contact Material: Bronze; DatasheetVersion: Rev. F, 12/2013; ComponentLink2URL: http://www.keyelco.com/product-pdf.cfm?p=1322; Contact Plating: Silver; ComponentLink1URL: http://www.keyelco.com/; Packaging: Bulk; ComponentLink1Description: Manufacturer URL; Colour: Orange; Height: 8.12 mm; RoHSCompliant: True; Mount: Through Hole; Mounting Technology: Through Hole
TP502 TP505 = TEST_POINT_RND_1MM: Test Point Round 1mm (NO BOM)
U500 = CMP-0057-00417-2: Dual 200mW Audio Power Amplifier with Shutdown Mode, 8-pin Narrow SOIC; Manufacturer: National Semiconductor; PackageTopMarking: NSZXTT*LM*4880M; PowerWise: N; CompType: Audio IC; PackageVersion: revM, May-2009; RevisionNote: Component URLs added; Code_IPC: SOIC127P600-8; ComponentLink2Description: LM4880 Web Page; ComponentLink3URL: http://www.national.com/packaging/folders/m08a.html; PackageDescription: SOIC Narrow, 4.9 x 3.9 x 1.45mm, 8 Lead, 1.27mm Pitch; PackageReference: M08A; PinCount: 8; RoHS: N; Code_JEDEC: MS-012-AA; ComponentLink1Description: LM4880 Datasheet; ComponentLink3Description: M08A Package Page; DatasheetVersion: Sep-2004; ComponentLink2URL: http://www.national.com/pf/LM/LM4880.html; ComponentLink1URL: http://www.national.com/ds/LM/LM4880.pdf
U501-U505 = TLV9161IDBVR: TLV916x 16-V, 11-MHz, Rail-to-Rail Input/Output, Low Offset Voltage, Low Noise Op Amp SOT-23-5; Manufacturer: Texas Instruments; Manufacturer Part Number: TLV9161IDBVR

## Sheet 6_Interfaces.SchDoc
size B; SheetNumber: 6; SheetTotal: 6
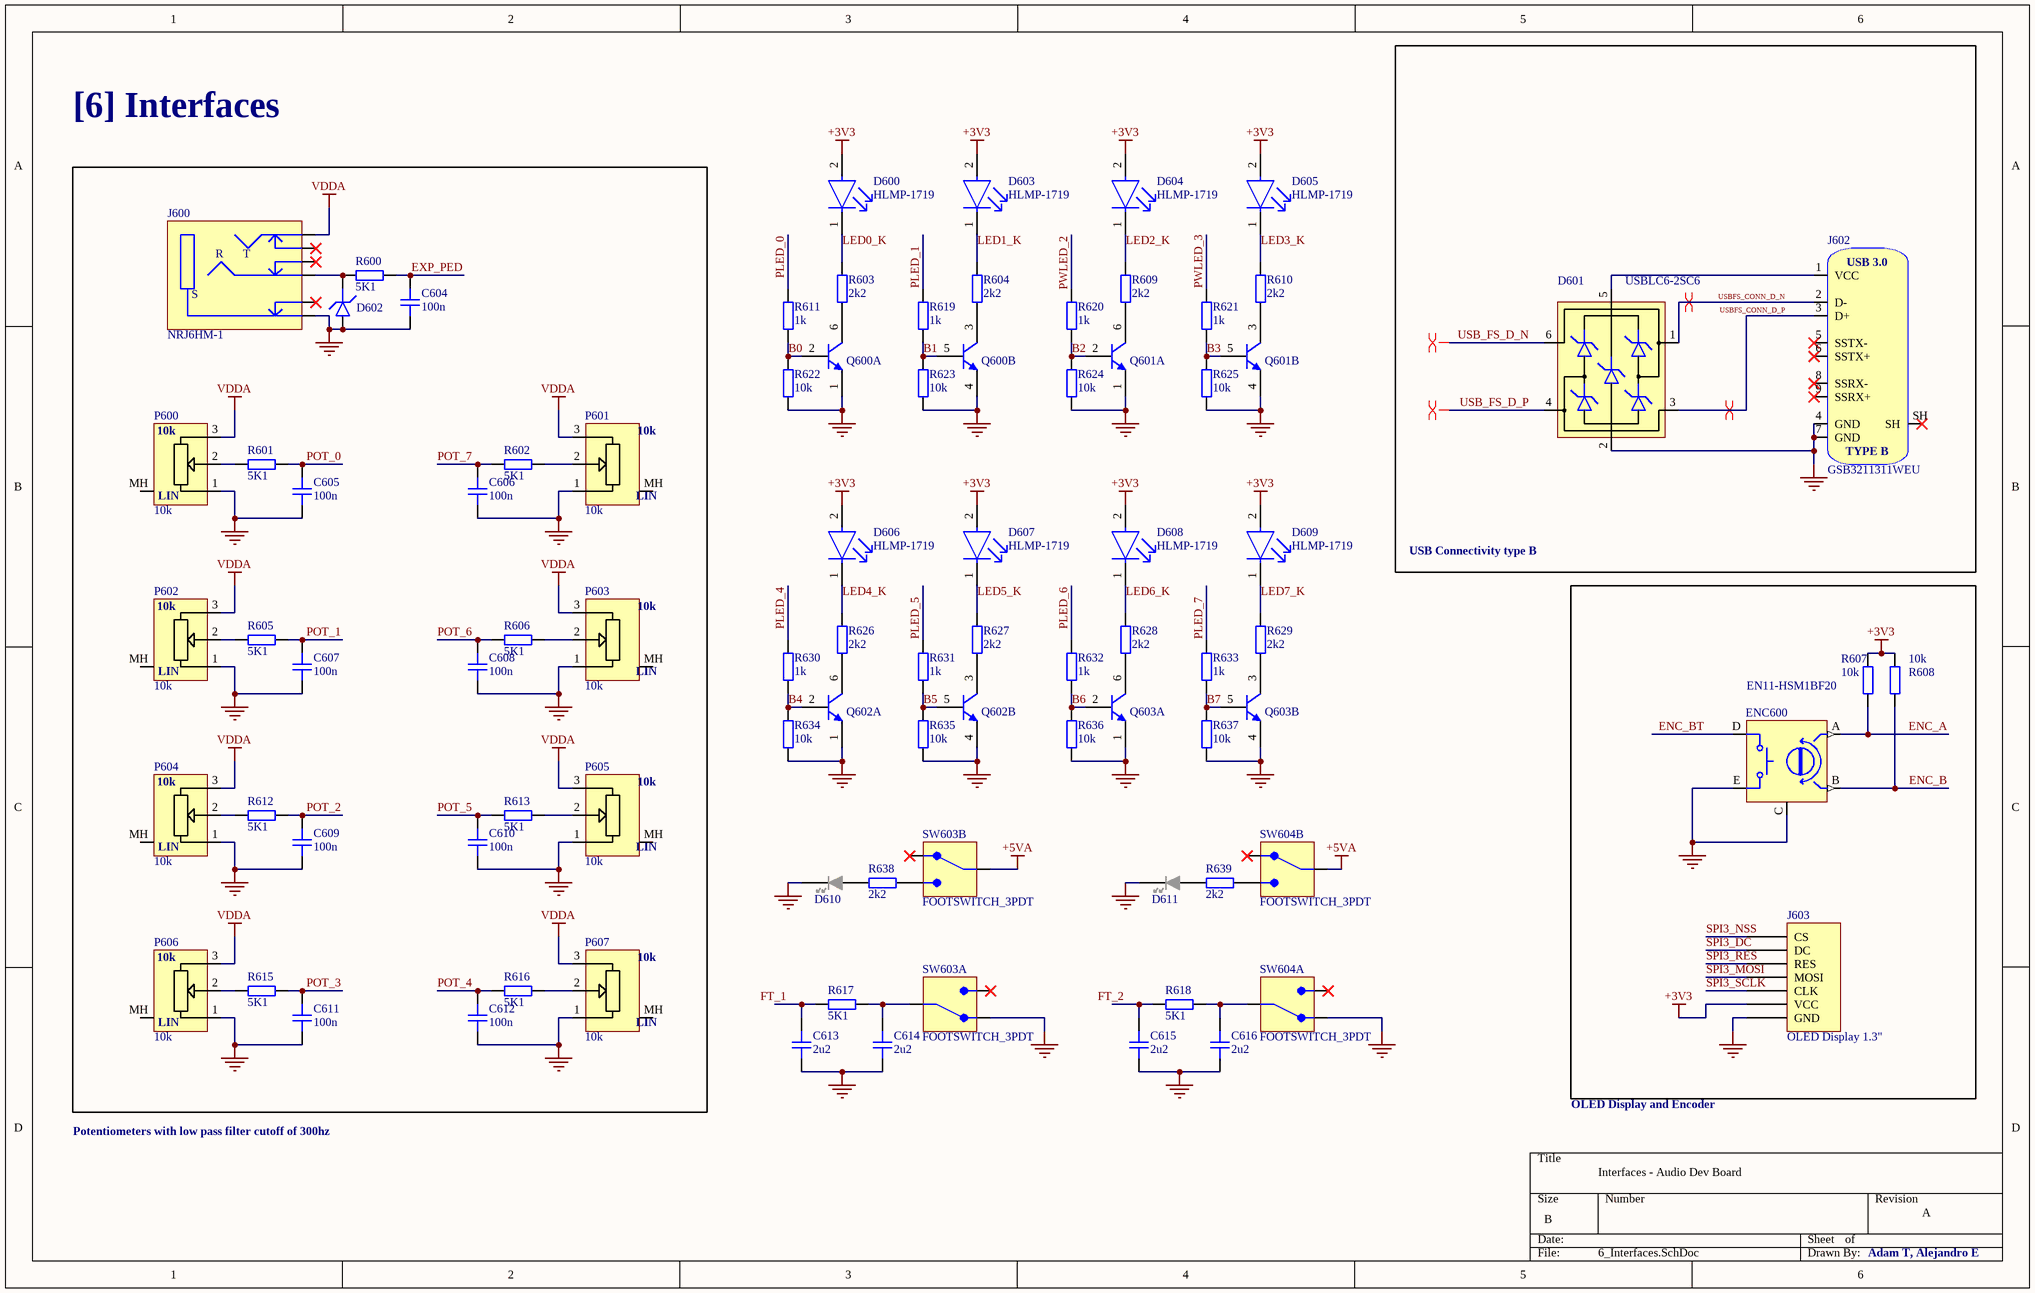
[diagram p5: 6_Interfaces.SchDoc]

### Parts
C604  100n  [CAP_0402]
C605  100n  [CAP_0402]
C606  100n  [CAP_0402]
C607  100n  [CAP_0402]
C608  100n  [CAP_0402]
C609  100n  [CAP_0402]
C610  100n  [CAP_0402]
C611  100n  [CAP_0402]
C612  100n  [CAP_0402]
C613  2u2  [CAP_0402]
C614  2u2  [CAP_0402]
C615  2u2  [CAP_0402]
C616  2u2  [CAP_0402]
D600  HLMP-1719  [FP-HLMP-1719-MFG]
D601  USBLC6-2SC6  [SOT-23-6]
D602  CG0402MLU-12G  [D_0402]  (value not drawn)
D603  HLMP-1719  [FP-HLMP-1719-MFG]
D604  HLMP-1719  [FP-HLMP-1719-MFG]
D605  HLMP-1719  [FP-HLMP-1719-MFG]
D606  HLMP-1719  [FP-HLMP-1719-MFG]
D607  HLMP-1719  [FP-HLMP-1719-MFG]
D608  HLMP-1719  [FP-HLMP-1719-MFG]
D609  HLMP-1719  [FP-HLMP-1719-MFG]
D610  LED  [SLM-530]  (value not drawn)
D611  LED  [SLM-530]  (value not drawn)
ENC600  EN11-HSM1BF20  [EN11-HSM]
J600  NRJ6HM-1  [NRJ6HM-1]
J602  GSB3211311WEU  [GSB3211311WEU]
J603  OLED Display 1.3"  [OLED Display: 128x64, 1.3",]
P600  10k  [P0915N-EC15BR10K]
P601  10k  [P0915N-EC15BR10K]
P602  10k  [P0915N-EC15BR10K]
P603  10k  [P0915N-EC15BR10K]
P604  10k  [P0915N-EC15BR10K]
P605  10k  [P0915N-EC15BR10K]
P606  10k  [P0915N-EC15BR10K]
P607  10k  [P0915N-EC15BR10K]
Q600  MBT3904DW1T1G  [ONSC-SOT-363-6-419B-02_W_V]  (value not drawn)  (parts A,B of 2)
Q601  MBT3904DW1T1G  [ONSC-SOT-363-6-419B-02_W_V]  (value not drawn)  (parts A,B of 2)
Q602  MBT3904DW1T1G  [ONSC-SOT-363-6-419B-02_W_V]  (value not drawn)  (parts A,B of 2)
Q603  MBT3904DW1T1G  [ONSC-SOT-363-6-419B-02_W_V]  (value not drawn)  (parts A,B of 2)
R600  5K1  [RES_0402]
R601  5K1  [RES_0402]
R602  5K1  [RES_0402]
R603  2k2  [RES_0402]
R604  2k2  [RES_0402]
R605  5K1  [RES_0402]
R606  5K1  [RES_0402]
R607  10k  [RES_0402]
R608  10k  [RES_0402]
R609  2k2  [RES_0402]
R610  2k2  [RES_0402]
R611  1k  [RES_0402]
R612  5K1  [RES_0402]
R613  5K1  [RES_0402]
R615  5K1  [RES_0402]
R616  5K1  [RES_0402]
R617  5K1  [RES_0402]
R618  5K1  [RES_0402]
R619  1k  [RES_0402]
R620  1k  [RES_0402]
R621  1k  [RES_0402]
R622  10k  [RES_0402]
R623  10k  [RES_0402]
R624  10k  [RES_0402]
R625  10k  [RES_0402]
R626  2k2  [RES_0402]
R627  2k2  [RES_0402]
R628  2k2  [RES_0402]
R629  2k2  [RES_0402]
R630  1k  [RES_0402]
R631  1k  [RES_0402]
R632  1k  [RES_0402]
R633  1k  [RES_0402]
R634  10k  [RES_0402]
R635  10k  [RES_0402]
R636  10k  [RES_0402]
R637  10k  [RES_0402]
R638  2k2  [RES_0402]
R639  2k2  [RES_0402]
SW603  FOOTSWITCH_3PDT  [FOOTSWITCH_3PDT]  (parts A,B of 3)
SW604  FOOTSWITCH_3PDT  [FOOTSWITCH_3PDT]  (parts A,B of 3)

### Blocks framed on the sheet
USB Connectivity type B: D601 J602

### Nets
+3V3: D600.2(A) D603.2(A) D604.2(A) D605.2(A) D606.2(A) D607.2(A) D608.2(A) D609.2(A) J603.VCC R607.2 R608.2
+5VA: SW603.COM2 SW604.COM2
GND: C604.1 C605.1 C606.1 C607.1 C608.1 C609.1 C610.1 C611.1 C612.1 C613.1 C614.1 C615.1 C616.1 D601.2(GND) D602.A D610.K D611.K ENC600.C(GND) ENC600.E J600.S J602.4(GND) J602.7(GND) J603.Gnd(GND) P600.1 P601.1 P602.1 P603.1 P604.1 P605.1 P606.1 P607.1 Q600.1(E) Q600.4(E) Q601.1(E) Q601.4(E) Q602.1(E) Q602.4(E) Q603.1(E) Q603.4(E) R622.1 R623.1 R624.1 R625.1 R634.1 R635.1 R636.1 R637.1 SW603.NC1 SW604.NC1
VDDA: J600.T P600.3 P601.3 P602.3 P603.3 P604.3 P605.3 P606.3 P607.3
B0: Q600.2(B) R611.1 R622.2
B1: Q600.5(B) R619.1 R623.2
B2: Q601.2(B) R620.1 R624.2
B3: Q601.5(B) R621.1 R625.2
B4: Q602.2(B) R630.1 R634.2
B5: Q602.5(B) R631.1 R635.2
B6: Q603.2(B) R632.1 R636.2
B7: Q603.5(B) R633.1 R637.2
ENC_A: ENC600.A R607.1
ENC_B: ENC600.B R608.1
ENC_BT: ENC600.D
EXP_PED: C604.2 R600.2
FT_1: C613.2 R617.1
FT_2: C615.2 R618.1
LED0_K: D600.1(C) R603.2
LED1_K: D603.1(C) R604.2
LED2_K: D604.1(C) R609.2
LED3_K: D605.1(C) R610.2
LED4_K: D606.1(C) R626.2
LED5_K: D607.1(C) R627.2
LED6_K: D608.1(C) R628.2
LED7_K: D609.1(C) R629.2
PLED_0: R611.2
PLED_1: R619.2
PLED_4: R630.2
PLED_5: R631.2
PLED_6: R632.2
PLED_7: R633.2
POT_0: C605.2 R601.2
POT_1: C607.2 R605.2
POT_2: C609.2 R612.2
POT_3: C611.2 R615.2
POT_4: C612.2 R616.1
POT_5: C610.2 R613.1
POT_6: C608.2 R606.1
POT_7: C606.2 R602.1
PWLED_2: R620.2
PWLED_3: R621.2
SPI3_DC: J603.DC
SPI3_MOSI: J603.MOSI
SPI3_NSS: J603.CS
SPI3_RES: J603.RES
SPI3_SCLK: J603.CLK
USB_FS_D_N: D601.6(IO1)
USB_FS_D_P: D601.4(IO2)
USBFS_CONN_D_N: D601.1(IO1) J602.2(D-)
USBFS_CONN_D_P: D601.3(IO2) J602.3(D+)
NetC614_2: C614.2 R617.2 SW603.COM1
NetC616_2: C616.2 R618.2 SW604.COM1
NetD601_5: D601.5(VBUS) J602.1(VCC)
NetD602_K: D602.K J600.R R600.1
NetD610_A: D610.A R638.2
NetD611_A: D611.A R639.2
NetP600_2: P600.2 R601.1
NetP601_2: P601.2 R602.2
NetP602_2: P602.2 R605.1
NetP603_2: P603.2 R606.2
NetP604_2: P604.2 R612.1
NetP605_2: P605.2 R613.2
NetP606_2: P606.2 R615.1
NetP607_2: P607.2 R616.2
NetQ600_3: Q600.3(C) R604.1
NetQ600_6: Q600.6(C) R603.1
NetQ601_3: Q601.3(C) R610.1
NetQ601_6: Q601.6(C) R609.1
NetQ602_3: Q602.3(C) R627.1
NetQ602_6: Q602.6(C) R626.1
NetQ603_3: Q603.3(C) R629.1
NetQ603_6: Q603.6(C) R628.1
NetR638_1: R638.1 SW603.NO2
NetR639_1: R639.1 SW604.NO2

Not connected (* = marked no-connect by the designer): J600 RN* SN* TN*; J602 5(SSTX-)* 6(SSTX+)* 8(SSRX-)* 9(SSRX+)* SH*; P600 MH; P601 MH; P602 MH; P603 MH; P604 MH; P605 MH; P606 MH; P607 MH; SW603 NC2* NO1*; SW604 NC2* NO1*

### Layout directives
differential pair; differential pair class DIFF_USB: USB_FS_D_N, USB_FS_D_P, USBFS_CONN_D_N, USBFS_CONN_D_P

### Notes on the sheet
- [6] Interfaces
- OLED Display and Encoder
- Potentiometers with low pass filter cutoff of 300hz
- Interfaces - Audio Dev Board
- A
- Adam T, Alejandro E
- (in symbol GSB3211311WEU) USB 3.0; TYPE B
- (in symbol P0915N-EC15BR10K) LIN

### Library data of the parts
C604-C616 = CAP_0402: Capacitor SMD 0402; Manufacturer: *; Manufacturer Part Number: *; Distributor Link: *; LCSC: *; Rating: *; Dielectric: *
D600 D603-D609 = CMP-2000-06410-2: LED YELLOW DIFFUSED T-1 T/H; Manufacturer: Broadcom; Wavelength: 585nm; Led Orientation: Straight; Luminous Intensity: 2.1mcd; Forward Voltage: 1.8V; Viewing Angle: 50°; Reverse Voltage: 5V; Power Dissipation: 17.5mW; Forward Current: 2mA; Lead Free: Yes; Automotive: No; Device Class L1: Optoelectronics; Mouser Description: Standard LEDs - Through Hole Yellow Diffused 585nm 2.1mcd; Digikey Description: LED YELLOW DIFFUSED T-1 T/H; Temperature: -40°C to +100°C; Temperature Range High: +100°C; Package: 0; Category: Diode; Colour: Yellow; Device Class L2: LEDs; ComponentLink2Description: Datasheet; ComponentLink2URL: https://docs.broadcom.com/docs/AV02-1557EN; Temperature Range Low: -40°C; Device Class L3: unset; Octopart: https://octopart.com/hlmp-1719-broadcom-71130405; RoHS: TRUE; Manufacturer Part Number: HLMP-1719
D601 = USBLC6-2SC6: Low-Capacitance ESD Protection USB; Manufacturer: STMicroelectronics; Manufacturer Part Number: USBLC6-2SC6; Distributor Link: https://www.mouser.de/ProductDetail/STMicroelectronics/USBLC6-2SC6?qs=po45yt2pPpu%2FhNIlwQdTlg%3D%3D
D602 = D_TVS_0402: Diode TVS / ESD 0402
D610 D611 = LED_5MM_HOLDER_17MM1: 5mm LED Holder Height 17.1mm (w/o LED); Manufacturer: BIVAR; Manufacturer Part Number: SLM-530
ENC600 = EN11-HSM1BF20: Rotary Encoder with Switch 20 Detents 7mm Bushing 20mm Threaded Shaft Vertical; Manufacturer: TT Electronics; Manufacturer Part Number: EN11-HSM1BF20; Distributor Link: https://www.mouser.de/ProductDetail/BI-Technologies-TT-Electronics/EN11-HSM1BF20?qs=%252BUYXD5bnyXp4Uf1MU7v3zw%3D%3D
J600 = NRJ6HM-1: 1/4" Stereo Jack, TRS Switched; Manufacturer: Neutrik; Manufacturer Part Number: NRJ6HM-1
J602 = GSB3211311WEU: USB Connector Type B 3.0 Through-Hole; Manufacturer: Amphenol; Manufacturer Part Number: GSB3211311WEU
J603 = OLED Display: 128x64, 1.3",: Poulolu OLED Display: 128x64, 1.3",
P600-P607 = P0915N-EC15BR10K: Potentiometer Vertical 10k Linear Taper THT PCB-Mount Smooth Shaft w/ Slot D=6mm L=15mm; Manufacturer: TT Electronics; Manufacturer Part Number: P0915N-EC15BR10K
Q600-Q603 = CMP-1048-00877-1: as Q402 on sheet 4_Codec; DatasheetVersion: Rev. 9; ComponentLink2Description: Datasheet; Mounting Technology: Surface Mount; PackageReference: SOT-363-6-419B-02_W; RoHS: TRUE; ComponentLink1Description: Manufacturer URL; ComponentLink2URL: http://www.onsemi.com/pub_link/Collateral/MBT3904DW1T1-D.PDF; PackageVersion: Rev. W, 01/2006; Packing: Tape and Reel; PartNumber: MBT3904DW1T1G; ComponentLink1URL: http://www.onsemi.com/; ComponentLink3URL: http://www.onsemi.com/pub_link/Collateral/NTJD4001N-D.PDF; ComponentLink3Description: Package Specification; PackageDescription: 6-Pin Small Outline Transistor, Body 2 x 1.25 mm, Pitch 0.65 mm
R600-R613 R615-R639 = RES_0402: Resistor SMD 0402
  R600-R602 R605-R608 R612 R613 R615-R618: Manufacturer: *; Manufacturer Part Number: *; Distributor Link: *; LCSC: *
SW603 SW604 = FOOTSWITCH_3PDT: Generic 3PDT Footswitch; Manufacturer: *; Manufacturer Part Number: *; Link: https://lovemyswitches.com/3pdt-latched-foot-switch-solder-lugs-black/

## Nets that join several sheets
+3V3: 2_Power (C201.2 D203.A U200.1 U200.3), 3_MCU (19 pins), 4_Codec (C400.1 C404.2 U400.5 U400.8), 6_Interfaces (11 pins)
+5VA: 2_Power (7 pins), 4_Codec (5 pins), Input/Analog Front-End (16 pins), 6_Interfaces (SW603.COM2 SW604.COM2), Outputs/Analog Back-End (16 pins)
AUDIO_OUT_L: 4_Codec (Q402.6), Input/Analog Front-End (7 pins), Outputs/Analog Back-End (7 pins)
AUDIO_OUT_R: 4_Codec (Q402.3), Input/Analog Front-End (6 pins), Outputs/Analog Back-End (6 pins)
GND: 2_Power (26 pins), 3_MCU (31 pins), 4_Codec (20 pins), Input/Analog Front-End (38 pins), 6_Interfaces (49 pins), Outputs/Analog Back-End (38 pins)
V_BIAS: 2_Power (U202.1 U202.4), Input/Analog Front-End (R507_Input/Analog_Front-End.2 R508_Input/Analog_Front-End.2 R515_Input/Analog_Front-End.2 R516_Input/Analog_Front-End.2), Outputs/Analog Back-End (R507_Outputs/Analog_Back-End.2 R508_Outputs/Analog_Back-End.2 R515_Outputs/Analog_Back-End.2 R516_Outputs/Analog_Back-End.2)
VDDA: 3_MCU (5 pins), 6_Interfaces (9 pins)
AUDIO_IN_L: Input/Analog Front-End (D500_Input/Analog_Front-End.K J500_Input/Analog_Front-End.T R509_Input/Analog_Front-End.1 TP500_Input/Analog_Front-End.1), Outputs/Analog Back-End (D500_Outputs/Analog_Back-End.K J500_Outputs/Analog_Back-End.T R509_Outputs/Analog_Back-End.1 TP500_Outputs/Analog_Back-End.1)
AUDIO_IN_R: Input/Analog Front-End (D502_Input/Analog_Front-End.K J502_Input/Analog_Front-End.T R517_Input/Analog_Front-End.1 TP503_Input/Analog_Front-End.1), Outputs/Analog Back-End (D502_Outputs/Analog_Back-End.K J502_Outputs/Analog_Back-End.T R517_Outputs/Analog_Back-End.1 TP503_Outputs/Analog_Back-End.1)
CODEC_IN_L: 4_Codec (U400.15), Input/Analog Front-End (C509_Input/Analog_Front-End.1 C513_Input/Analog_Front-End.2 TP502_Input/Analog_Front-End.1), Outputs/Analog Back-End (C509_Outputs/Analog_Back-End.1 C513_Outputs/Analog_Back-End.2 TP502_Outputs/Analog_Back-End.1)
CODEC_IN_R: 4_Codec (U400.16), Input/Analog Front-End (C518_Input/Analog_Front-End.1 C522_Input/Analog_Front-End.2 TP505_Input/Analog_Front-End.1), Outputs/Analog Back-End (C518_Outputs/Analog_Back-End.1 C522_Outputs/Analog_Back-End.2 TP505_Outputs/Analog_Back-End.1)
CODEC_OUT_L: 4_Codec (U400.22), Input/Analog Front-End (C510_Input/Analog_Front-End.1), Outputs/Analog Back-End (C510_Outputs/Analog_Back-End.1)
CODEC_OUT_R: 4_Codec (U400.23), Input/Analog Front-End (C519_Input/Analog_Front-End.1), Outputs/Analog Back-End (C519_Outputs/Analog_Back-End.1)
ENC_A: 3_MCU (U300.67), 6_Interfaces (ENC600.A R607.1)
ENC_B: 3_MCU (U300.68), 6_Interfaces (ENC600.B R608.1)
ENC_BT: 3_MCU (U300.65), 6_Interfaces (ENC600.D)
EXP_PED: 3_MCU (U300.30), 6_Interfaces (C604.2 R600.2)
FT_1: 3_MCU (U300.97), 6_Interfaces (C613.2 R617.1)
FT_2: 3_MCU (U300.96), 6_Interfaces (C615.2 R618.1)
HP_AMP_SDP: Input/Analog Front-End (Q502_Input/Analog_Front-End.3 R504_Input/Analog_Front-End.1 U500_Input/Analog_Front-End.5), Outputs/Analog Back-End (Q502_Outputs/Analog_Back-End.3 R504_Outputs/Analog_Back-End.1 U500_Outputs/Analog_Back-End.5)
HP_Bypass: Input/Analog Front-End (C504_Input/Analog_Front-End.2 U500_Input/Analog_Front-End.3), Outputs/Analog Back-End (C504_Outputs/Analog_Back-End.2 U500_Outputs/Analog_Back-End.3)
HP_F_INL: Input/Analog Front-End (R501_Input/Analog_Front-End.1 R502_Input/Analog_Front-End.2 U500_Input/Analog_Front-End.2), Outputs/Analog Back-End (R501_Outputs/Analog_Back-End.1 R502_Outputs/Analog_Back-End.2 U500_Outputs/Analog_Back-End.2)
HP_F_INR: Input/Analog Front-End (R500_Input/Analog_Front-End.1 R503_Input/Analog_Front-End.2 U500_Input/Analog_Front-End.6), Outputs/Analog Back-End (R500_Outputs/Analog_Back-End.1 R503_Outputs/Analog_Back-End.2 U500_Outputs/Analog_Back-End.6)
HP_IN_B: Input/Analog Front-End (C500_Input/Analog_Front-End.2 Q500_Input/Analog_Front-End.3 Q501_Input/Analog_Front-End.3), Outputs/Analog Back-End (C500_Outputs/Analog_Back-End.2 Q500_Outputs/Analog_Back-End.3 Q501_Outputs/Analog_Back-End.3)
HP_ON_SW: Input/Analog Front-End (J504_Input/Analog_Front-End.4 Q502_Input/Analog_Front-End.1 R525_Input/Analog_Front-End.1), Outputs/Analog Back-End (J504_Outputs/Analog_Back-End.4 Q502_Outputs/Analog_Back-End.1 R525_Outputs/Analog_Back-End.1)
HP_OUTL: Input/Analog Front-End (C502_Input/Analog_Front-End.2 J504_Input/Analog_Front-End.2 R506_Input/Analog_Front-End.2), Outputs/Analog Back-End (C502_Outputs/Analog_Back-End.2 J504_Outputs/Analog_Back-End.2 R506_Outputs/Analog_Back-End.2)
HP_OUTR: Input/Analog Front-End (C503_Input/Analog_Front-End.2 J504_Input/Analog_Front-End.3 R505_Input/Analog_Front-End.2), Outputs/Analog Back-End (C503_Outputs/Analog_Back-End.2 J504_Outputs/Analog_Back-End.3 R505_Outputs/Analog_Back-End.2)
HP_PF_INL: Input/Analog Front-End (C501_Input/Analog_Front-End.2 R502_Input/Analog_Front-End.1), Outputs/Analog Back-End (C501_Outputs/Analog_Back-End.2 R502_Outputs/Analog_Back-End.1)
HP_PF_INR: Input/Analog Front-End (C500_Input/Analog_Front-End.1 R503_Input/Analog_Front-End.1), Outputs/Analog Back-End (C500_Outputs/Analog_Back-End.1 R503_Outputs/Analog_Back-End.1)
HP_PF_OUTL: Input/Analog Front-End (C502_Input/Analog_Front-End.1 R501_Input/Analog_Front-End.2 U500_Input/Analog_Front-End.1), Outputs/Analog Back-End (C502_Outputs/Analog_Back-End.1 R501_Outputs/Analog_Back-End.2 U500_Outputs/Analog_Back-End.1)
HP_PF_OUTR: Input/Analog Front-End (C503_Input/Analog_Front-End.1 R500_Input/Analog_Front-End.2 U500_Input/Analog_Front-End.7), Outputs/Analog Back-End (C503_Outputs/Analog_Back-End.1 R500_Outputs/Analog_Back-End.2 U500_Outputs/Analog_Back-End.7)
I2C1_SCL: 3_MCU (R300.1 U300.92), 4_Codec (U400.10)
I2C1_SDA: 3_MCU (R301.1 U300.93), 4_Codec (U400.9)
IN_L_BUF_IN: Input/Analog Front-End (C508_Input/Analog_Front-End.2 R507_Input/Analog_Front-End.1 U501_Input/Analog_Front-End.3), Outputs/Analog Back-End (C508_Outputs/Analog_Back-End.2 R507_Outputs/Analog_Back-End.1 U501_Outputs/Analog_Back-End.3)
IN_L_BUF_OUT: Input/Analog Front-End (R510_Input/Analog_Front-End.1 U501_Input/Analog_Front-End.1 U501_Input/Analog_Front-End.4), Outputs/Analog Back-End (R510_Outputs/Analog_Back-End.1 U501_Outputs/Analog_Back-End.1 U501_Outputs/Analog_Back-End.4)
IN_L_FILT: Input/Analog Front-End (C518_Input/Analog_Front-End.2 R518_Input/Analog_Front-End.2 SW501_Input/Analog_Front-End.2), Outputs/Analog Back-End (C518_Outputs/Analog_Back-End.2 R518_Outputs/Analog_Back-End.2 SW501_Outputs/Analog_Back-End.2)
IN_L_RF: Input/Analog Front-End (C508_Input/Analog_Front-End.1 C512_Input/Analog_Front-End.2 R509_Input/Analog_Front-End.2 R513_Input/Analog_Front-End.2), Outputs/Analog Back-End (C508_Outputs/Analog_Back-End.1 C512_Outputs/Analog_Back-End.2 R509_Outputs/Analog_Back-End.2 R513_Outputs/Analog_Back-End.2)
IN_R_BUF_IN: Input/Analog Front-End (C517_Input/Analog_Front-End.2 R515_Input/Analog_Front-End.1 U503_Input/Analog_Front-End.3), Outputs/Analog Back-End (C517_Outputs/Analog_Back-End.2 R515_Outputs/Analog_Back-End.1 U503_Outputs/Analog_Back-End.3)
IN_R_BUF_OUT: Input/Analog Front-End (R518_Input/Analog_Front-End.1 U503_Input/Analog_Front-End.1 U503_Input/Analog_Front-End.4), Outputs/Analog Back-End (R518_Outputs/Analog_Back-End.1 U503_Outputs/Analog_Back-End.1 U503_Outputs/Analog_Back-End.4)
IN_R_FILT: Input/Analog Front-End (C509_Input/Analog_Front-End.2 R510_Input/Analog_Front-End.2 SW501_Input/Analog_Front-End.5), Outputs/Analog Back-End (C509_Outputs/Analog_Back-End.2 R510_Outputs/Analog_Back-End.2 SW501_Outputs/Analog_Back-End.5)
IN_R_RF: Input/Analog Front-End (C517_Input/Analog_Front-End.1 C521_Input/Analog_Front-End.2 R517_Input/Analog_Front-End.2 R521_Input/Analog_Front-End.2), Outputs/Analog Back-End (C517_Outputs/Analog_Back-End.1 C521_Outputs/Analog_Back-End.2 R517_Outputs/Analog_Back-End.2 R521_Outputs/Analog_Back-End.2)
MCU_CODEC_RST: 3_MCU (U300.7), 4_Codec (C408.2 R401.2)
Mono_BUF_OUT: Input/Analog Front-End (Q500_Input/Analog_Front-End.2 U505_Input/Analog_Front-End.1 U505_Input/Analog_Front-End.4), Outputs/Analog Back-End (Q500_Outputs/Analog_Back-End.2 U505_Outputs/Analog_Back-End.1 U505_Outputs/Analog_Back-End.4)
Mono_CS: Input/Analog Front-End (Q500_Input/Analog_Front-End.1 Q503_Input/Analog_Front-End.3 R526_Input/Analog_Front-End.2), Outputs/Analog Back-End (Q500_Outputs/Analog_Back-End.1 Q503_Outputs/Analog_Back-End.3 R526_Outputs/Analog_Back-End.2)
OUT_L_BUF: Input/Analog Front-End (C514_Input/Analog_Front-End.2 R511_Input/Analog_Front-End.1 U502_Input/Analog_Front-End.3), Outputs/Analog Back-End (C514_Outputs/Analog_Back-End.2 R511_Outputs/Analog_Back-End.1 U502_Outputs/Analog_Back-End.3)
OUT_L_BUF_OUT: Input/Analog Front-End (R512_Input/Analog_Front-End.2 U502_Input/Analog_Front-End.1 U502_Input/Analog_Front-End.4), Outputs/Analog Back-End (R512_Outputs/Analog_Back-End.2 U502_Outputs/Analog_Back-End.1 U502_Outputs/Analog_Back-End.4)
OUT_L_FIL: Input/Analog Front-End (C510_Input/Analog_Front-End.2 R508_Input/Analog_Front-End.1 R511_Input/Analog_Front-End.2), Outputs/Analog Back-End (C510_Outputs/Analog_Back-End.2 R508_Outputs/Analog_Back-End.1 R511_Outputs/Analog_Back-End.2)
OUT_L_RC: Input/Analog Front-End (C511_Input/Analog_Front-End.1 R512_Input/Analog_Front-End.1), Outputs/Analog Back-End (C511_Outputs/Analog_Back-End.1 R512_Outputs/Analog_Back-End.1)
OUT_R_BUF: Input/Analog Front-End (C523_Input/Analog_Front-End.2 R519_Input/Analog_Front-End.1 U504_Input/Analog_Front-End.3), Outputs/Analog Back-End (C523_Outputs/Analog_Back-End.2 R519_Outputs/Analog_Back-End.1 U504_Outputs/Analog_Back-End.3)
OUT_R_BUF_OUT: Input/Analog Front-End (R520_Input/Analog_Front-End.2 U504_Input/Analog_Front-End.1 U504_Input/Analog_Front-End.4), Outputs/Analog Back-End (R520_Outputs/Analog_Back-End.2 U504_Outputs/Analog_Back-End.1 U504_Outputs/Analog_Back-End.4)
OUT_R_FIL: Input/Analog Front-End (C519_Input/Analog_Front-End.2 R516_Input/Analog_Front-End.1 R519_Input/Analog_Front-End.2), Outputs/Analog Back-End (C519_Outputs/Analog_Back-End.2 R516_Outputs/Analog_Back-End.1 R519_Outputs/Analog_Back-End.2)
OUT_R_RC: Input/Analog Front-End (C520_Input/Analog_Front-End.1 R520_Input/Analog_Front-End.1), Outputs/Analog Back-End (C520_Outputs/Analog_Back-End.1 R520_Outputs/Analog_Back-End.1)
PLED_0: 3_MCU (U300.35), 6_Interfaces (R611.2)
PLED_1: 3_MCU (U300.36), 6_Interfaces (R619.2)
PLED_4: 3_MCU (U300.23), 6_Interfaces (R630.2)
PLED_5: 3_MCU (U300.22), 6_Interfaces (R631.2)
PLED_6: 3_MCU (U300.18), 6_Interfaces (R632.2)
PLED_7: 3_MCU (U300.17), 6_Interfaces (R633.2)
POT_0: 3_MCU (U300.32), 6_Interfaces (C605.2 R601.2)
POT_1: 3_MCU (U300.34), 6_Interfaces (C607.2 R605.2)
POT_2: 3_MCU (U300.33), 6_Interfaces (C609.2 R612.2)
POT_3: 3_MCU (U300.28), 6_Interfaces (C611.2 R615.2)
POT_4: 3_MCU (U300.25), 6_Interfaces (C612.2 R616.1)
POT_5: 3_MCU (U300.24), 6_Interfaces (C610.2 R613.1)
POT_6: 3_MCU (U300.16), 6_Interfaces (C608.2 R606.1)
POT_7: 3_MCU (U300.15), 6_Interfaces (C606.2 R602.1)
PWLED_2: 3_MCU (U300.31), 6_Interfaces (R620.2)
PWLED_3: 3_MCU (U300.29), 6_Interfaces (R621.2)
SAI1_FS_A: 3_MCU (U300.3), 4_Codec (U400.2)
SAI1_MCLK_A: 3_MCU (U300.1), 4_Codec (U400.3)
SAI1_SCK_A: 3_MCU (U300.4), 4_Codec (U400.4)
SAI1_SD_A: 3_MCU (U300.5), 4_Codec (U400.1)
SAI1_SD_B: 3_MCU (U300.2), 4_Codec (R400.1 R405.2)
SPI3_DC: 3_MCU (U300.81), 6_Interfaces (J603.DC)
SPI3_MOSI: 3_MCU (U300.80), 6_Interfaces (J603.MOSI)
SPI3_NSS: 3_MCU (U300.77), 6_Interfaces (J603.CS)
SPI3_RES: 3_MCU (U300.82), 6_Interfaces (J603.RES)
SPI3_SCLK: 3_MCU (U300.78), 6_Interfaces (J603.CLK)
Stereo_CS: Input/Analog Front-End (J502_Input/Analog_Front-End.SN Q501_Input/Analog_Front-End.1 Q503_Input/Analog_Front-End.1 R527_Input/Analog_Front-End.2), Outputs/Analog Back-End (J502_Outputs/Analog_Back-End.SN Q501_Outputs/Analog_Back-End.1 Q503_Outputs/Analog_Back-End.1 R527_Outputs/Analog_Back-End.2)
USB_FS_D_N: 3_MCU (U300.70), 6_Interfaces (D601.6)
USB_FS_D_P: 3_MCU (U300.71), 6_Interfaces (D601.4)